# EAGLE design testBoard (EAGLE 9.5.2)
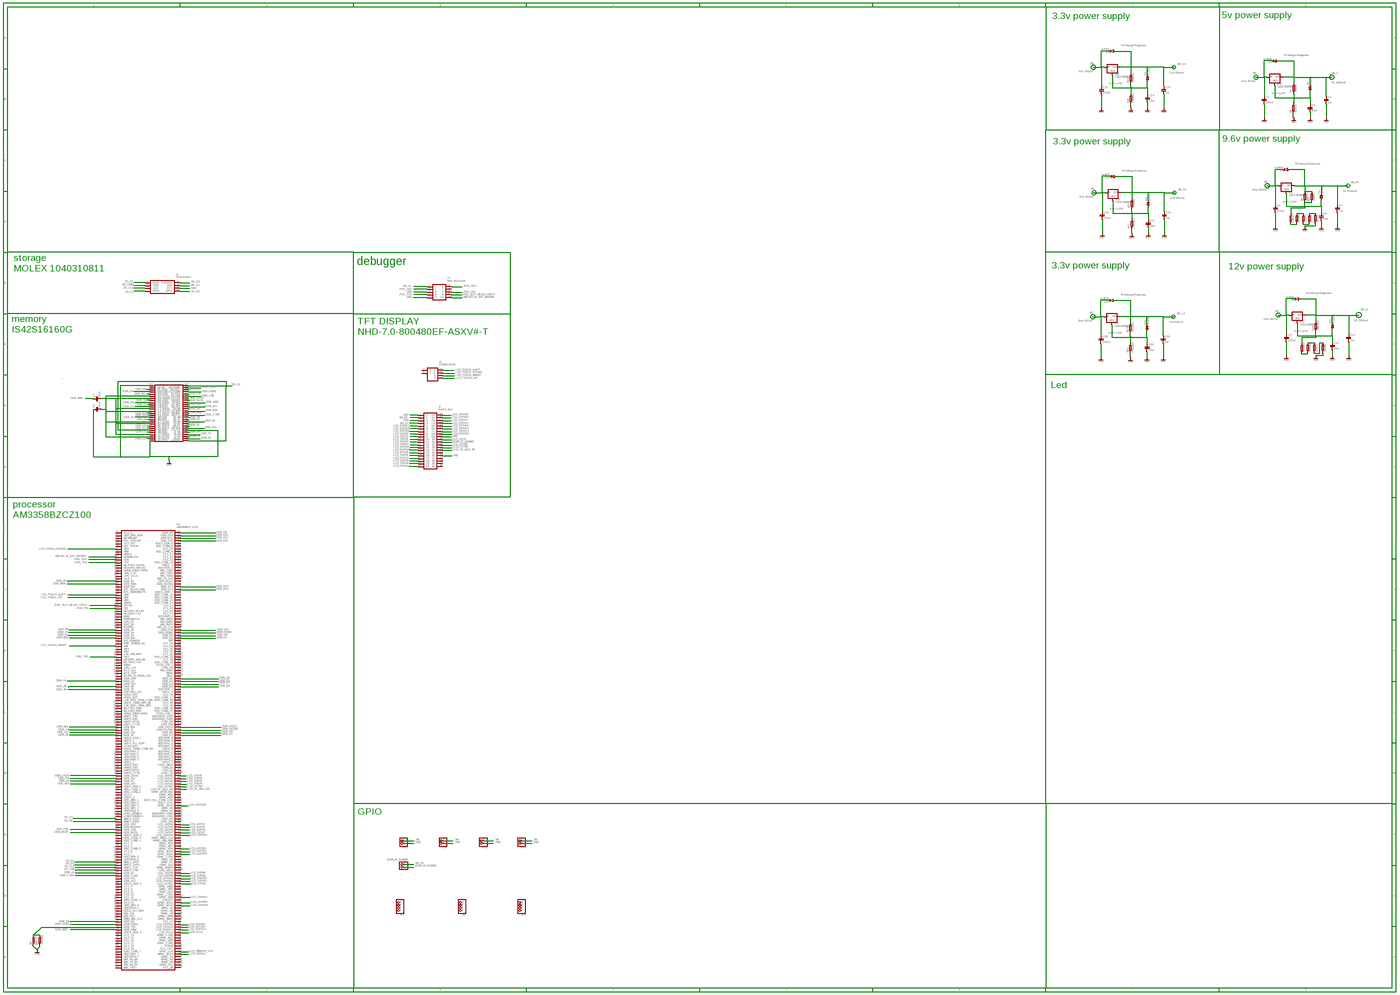
[diagram p0: schematic, sheet 1, overview]
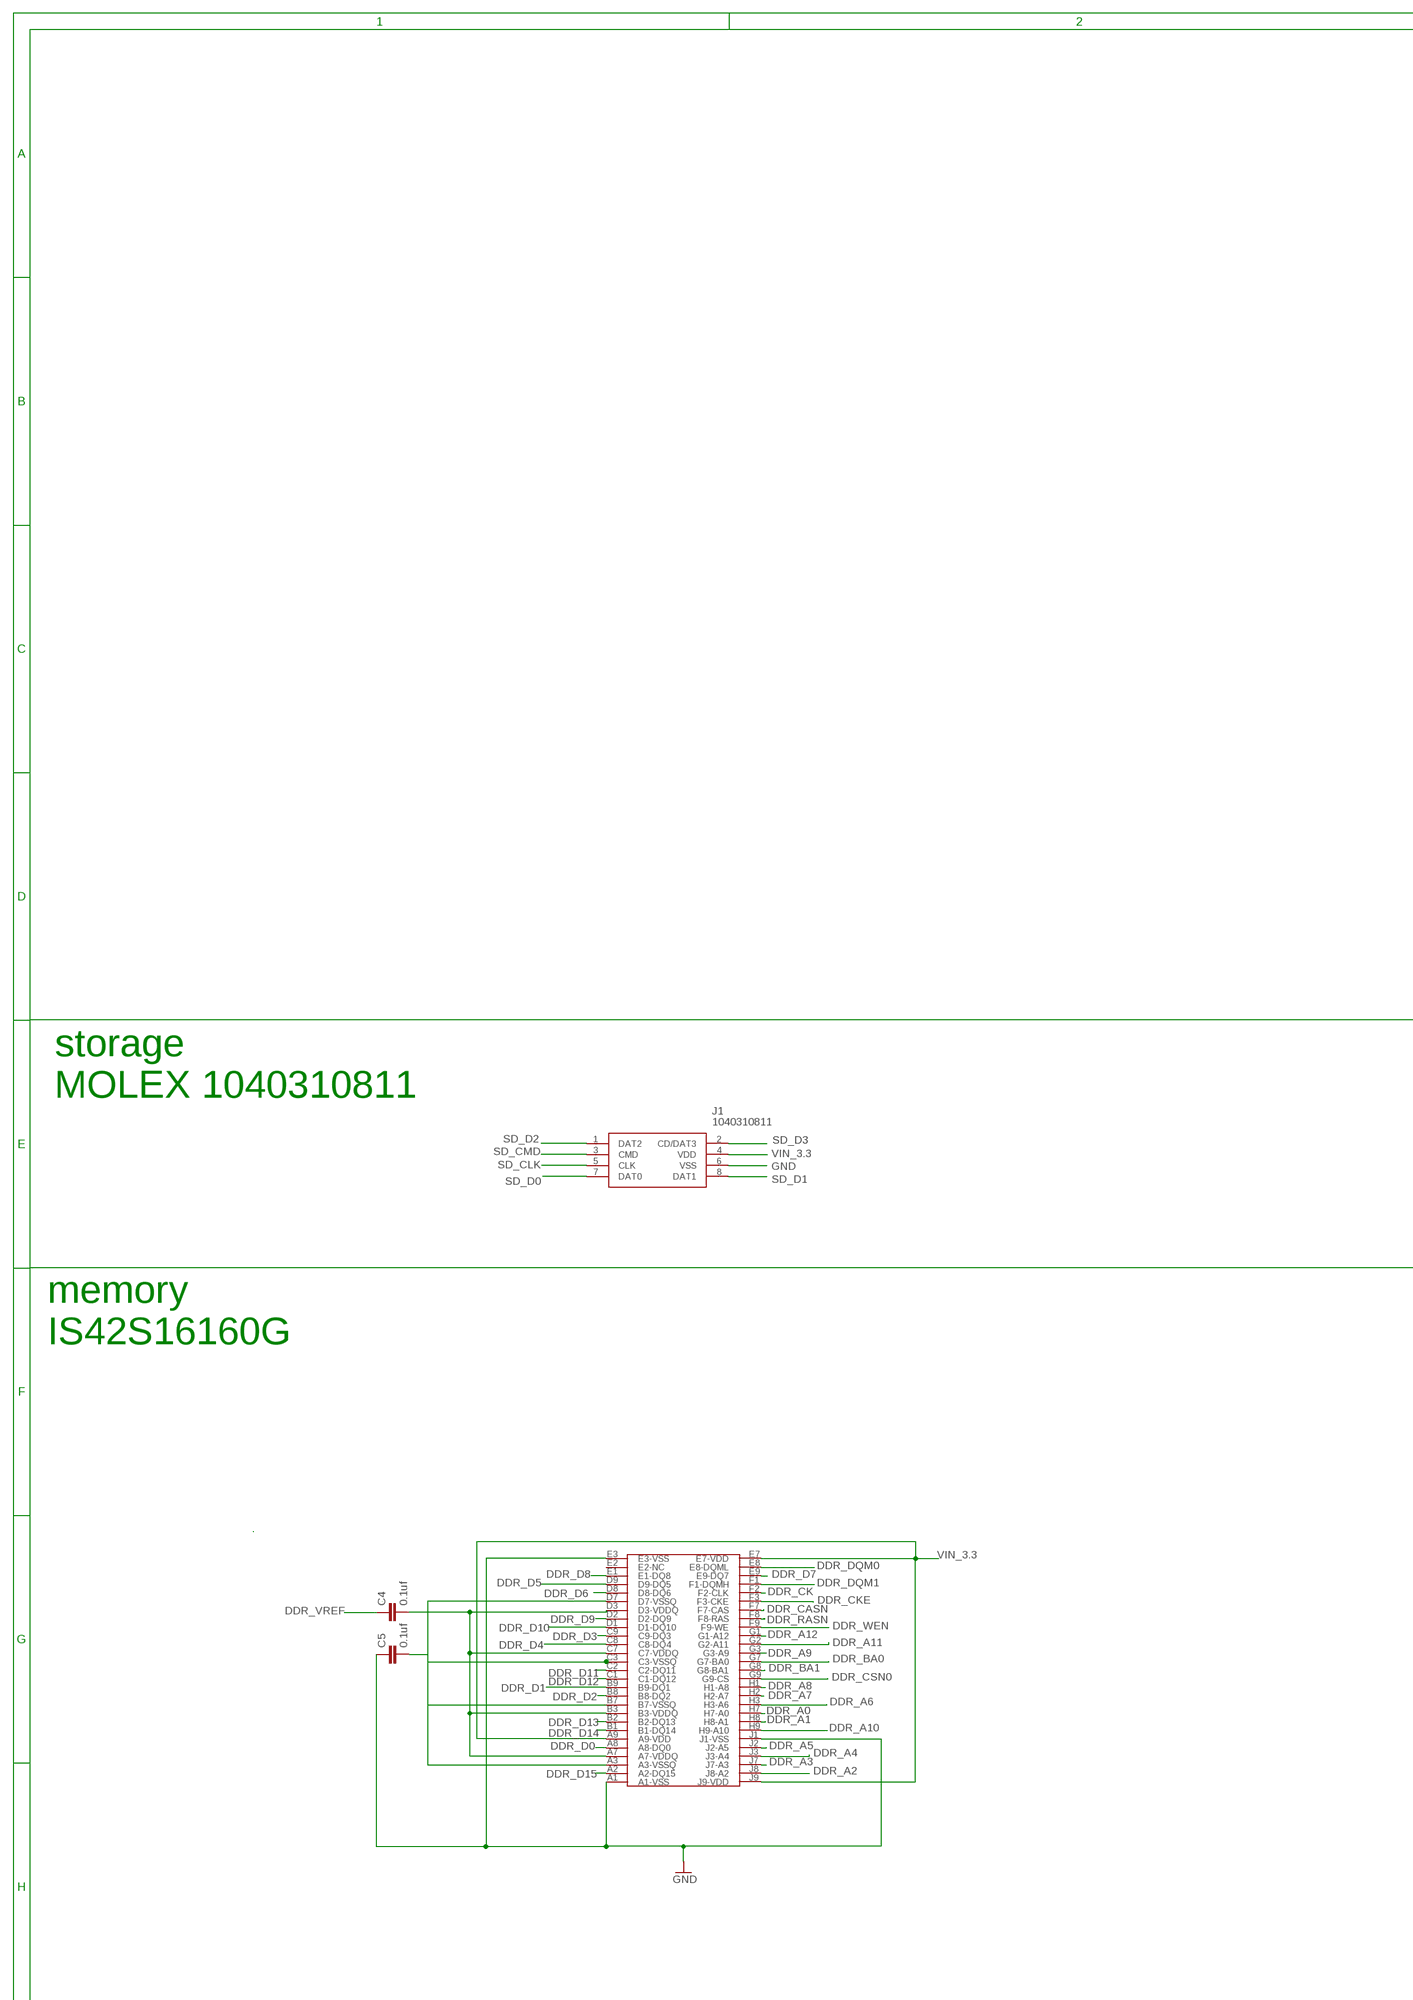
[diagram p1: schematic, sheet 1, part 1 of 8]
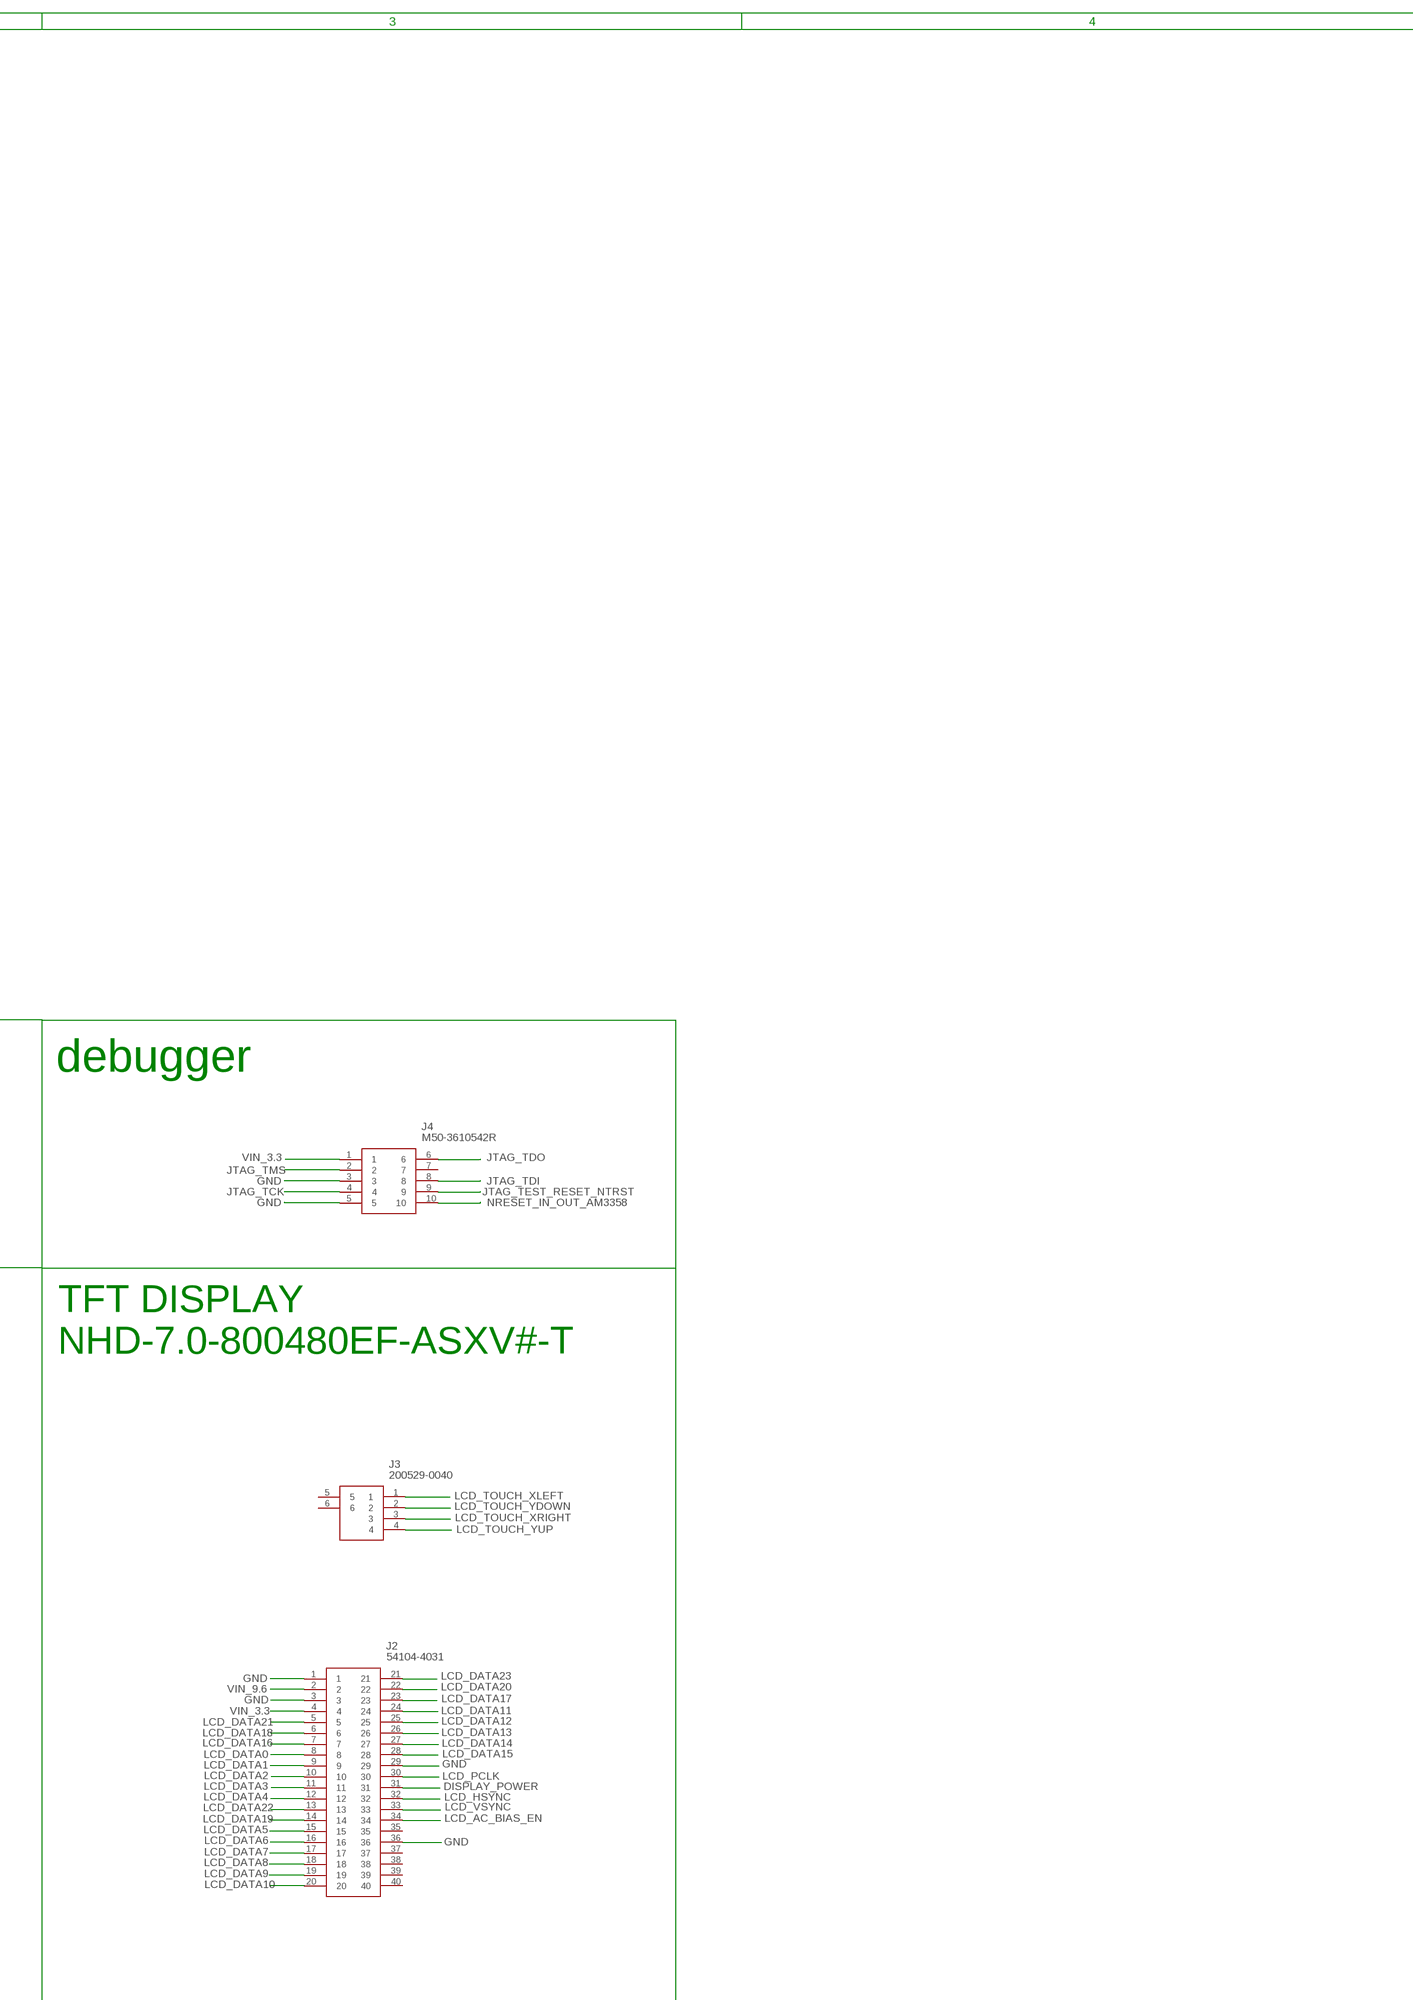
[diagram p2: schematic, sheet 1, part 2 of 8]
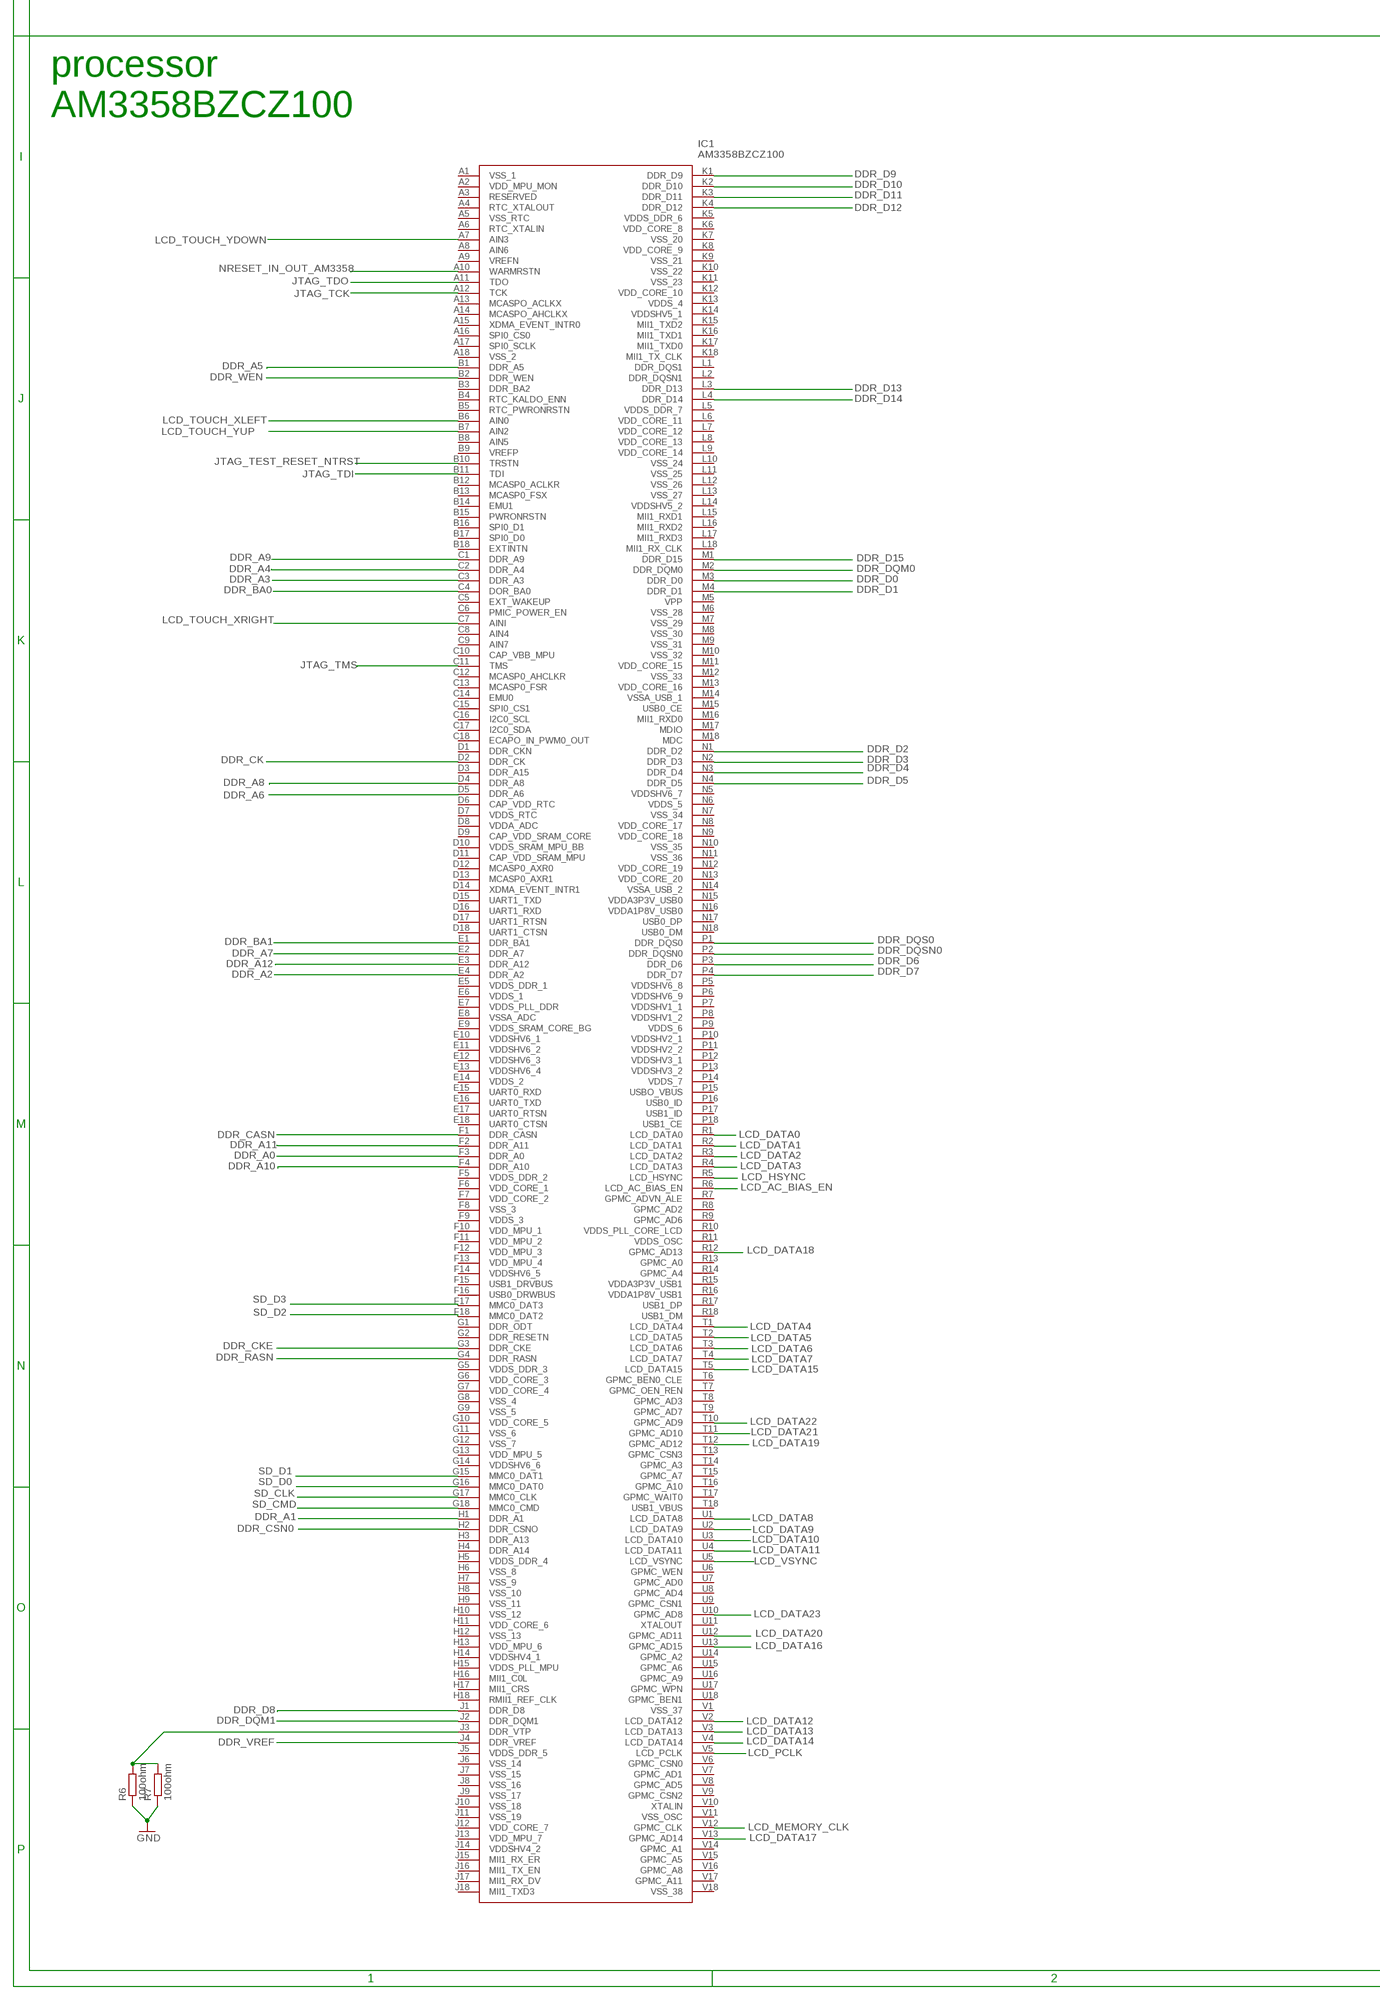
[diagram p3: schematic, sheet 1, part 3 of 8]
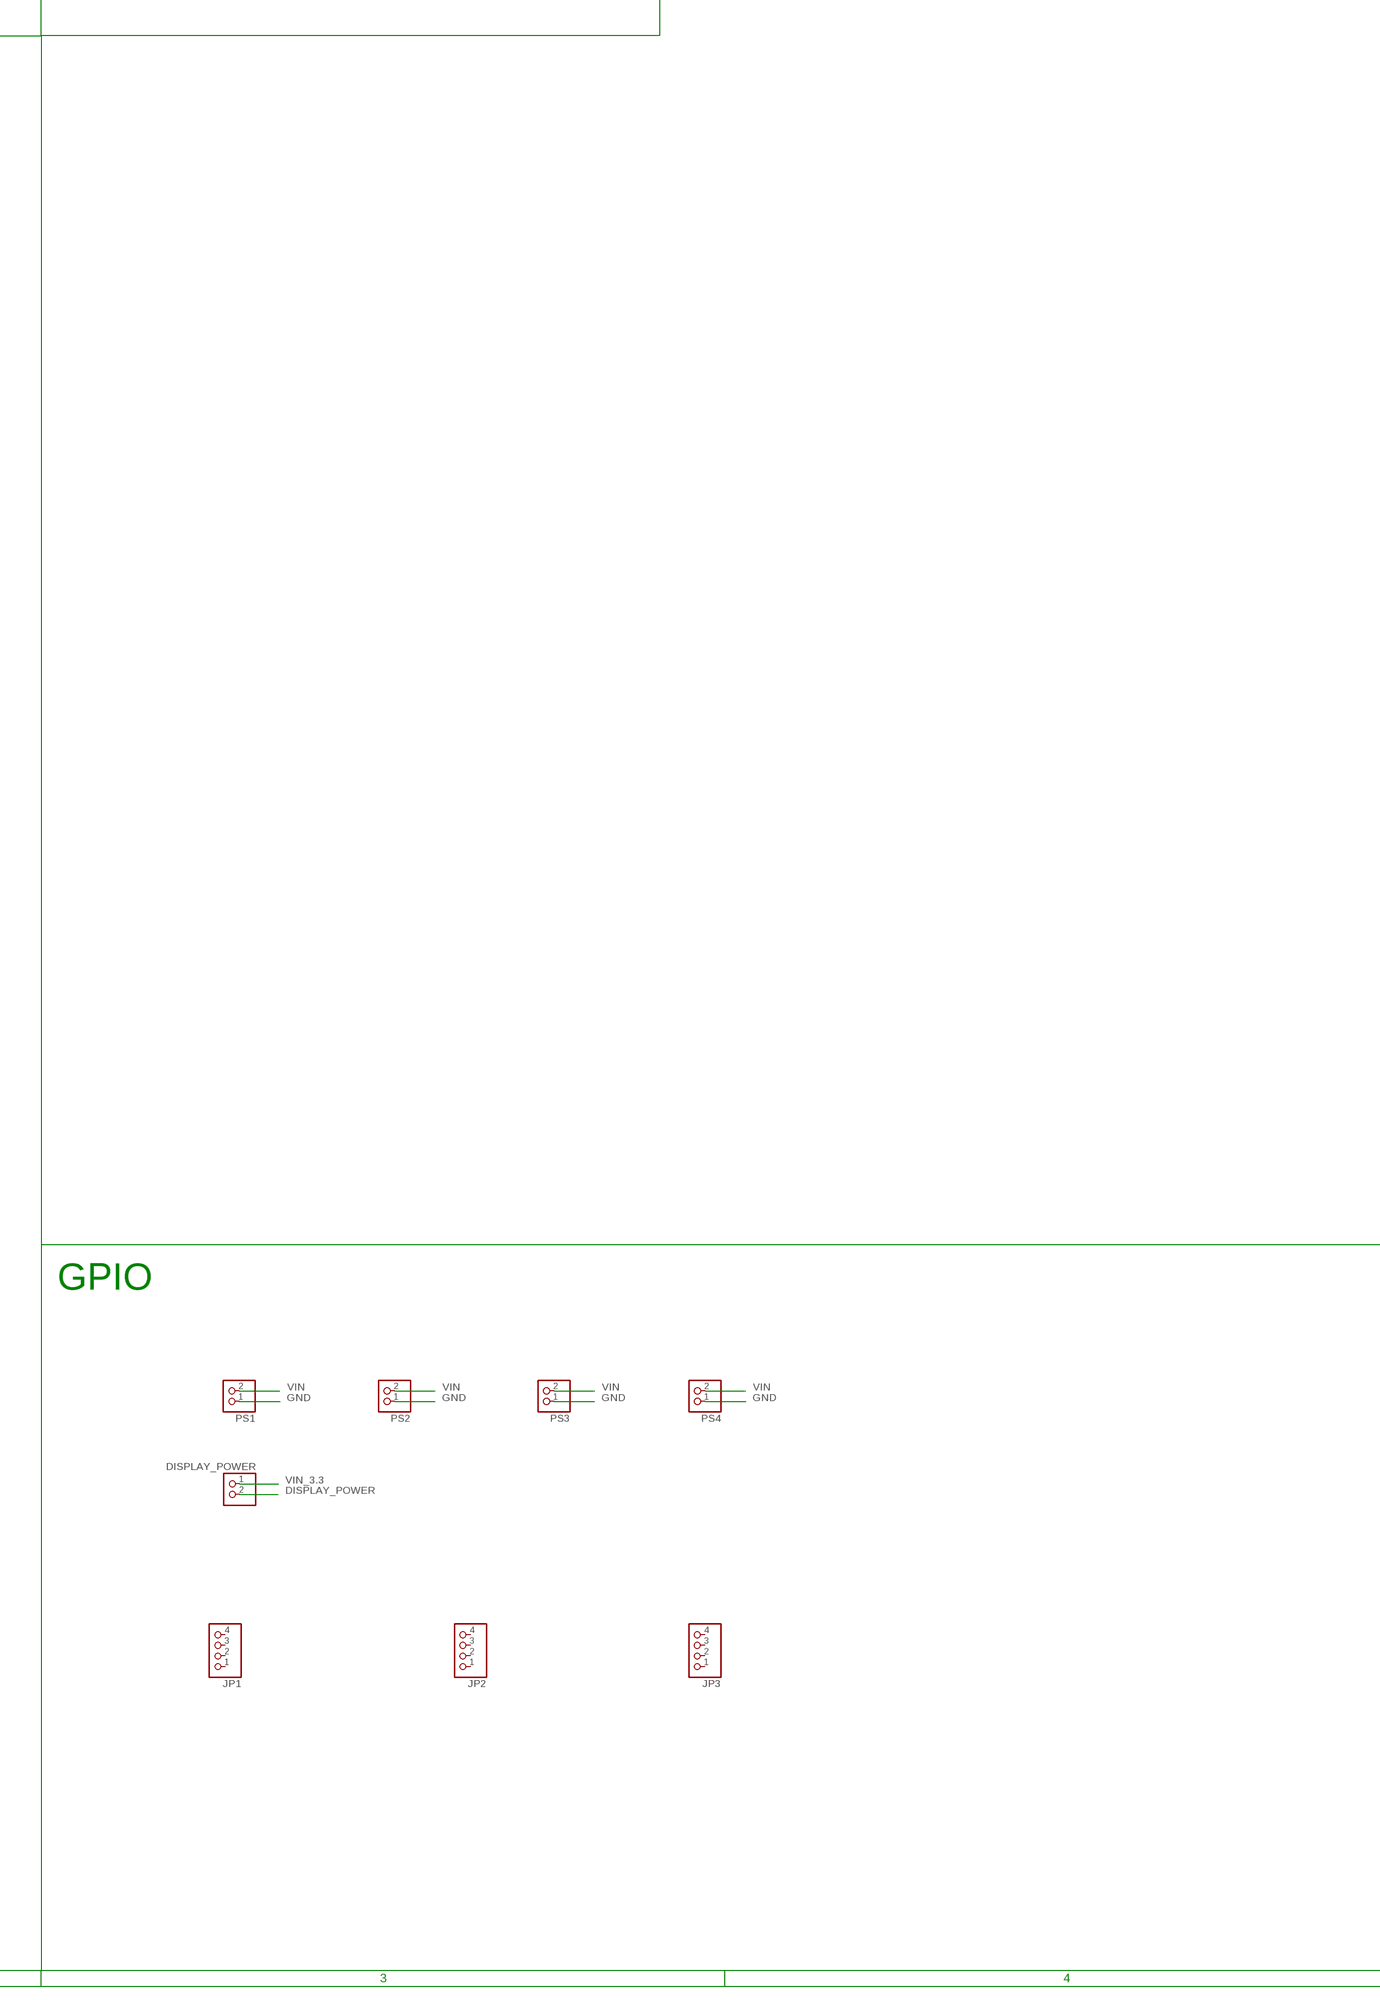
[diagram p4: schematic, sheet 1, part 4 of 8]
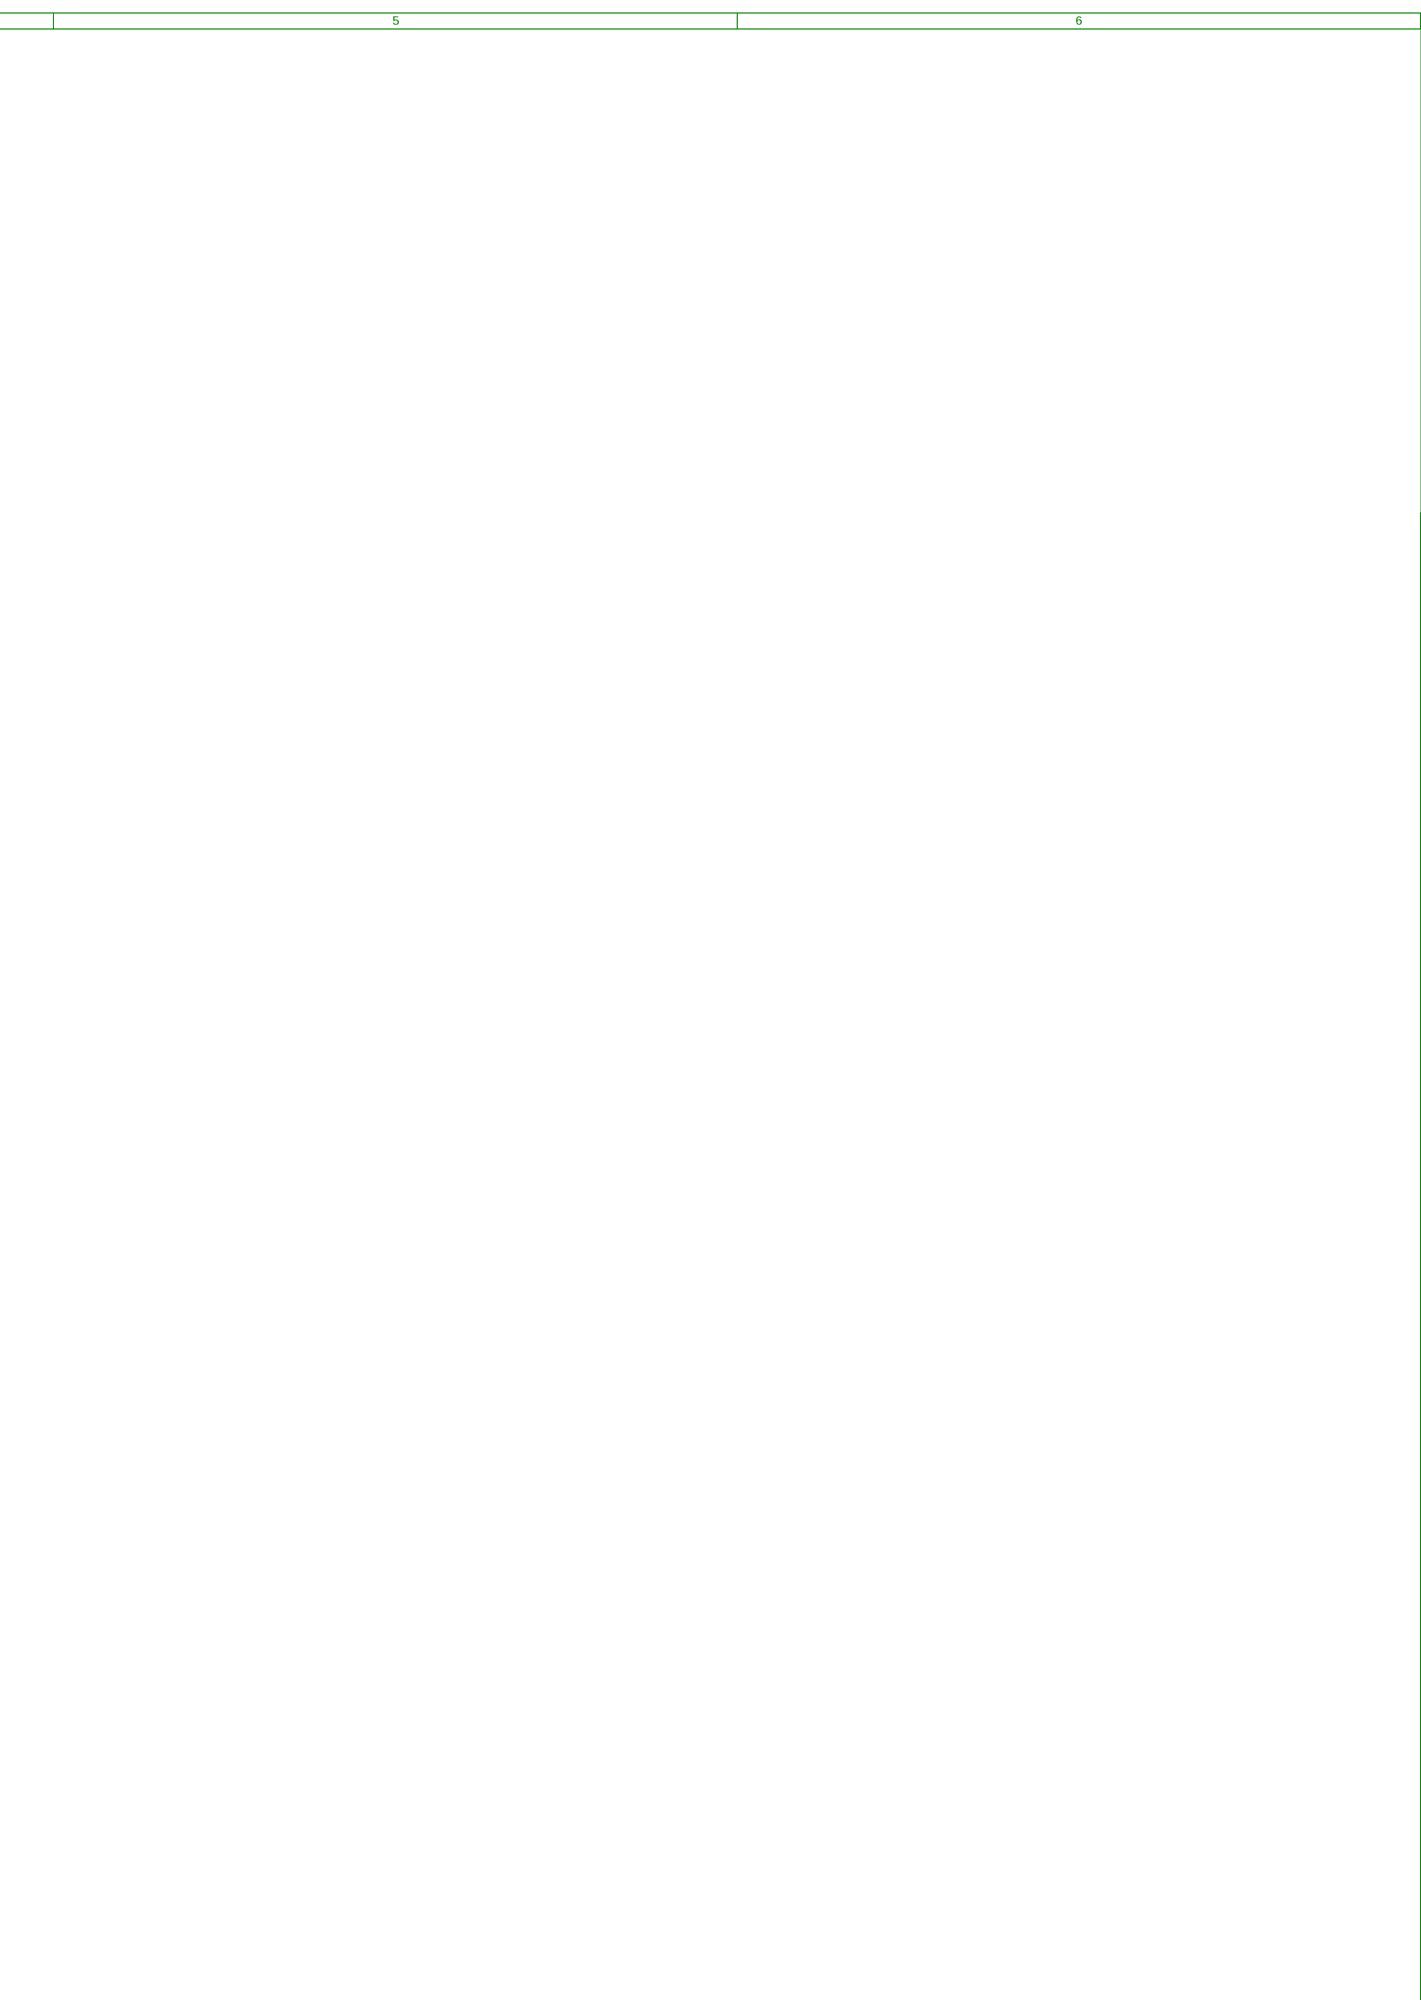
[diagram p5: schematic, sheet 1, part 5 of 8]
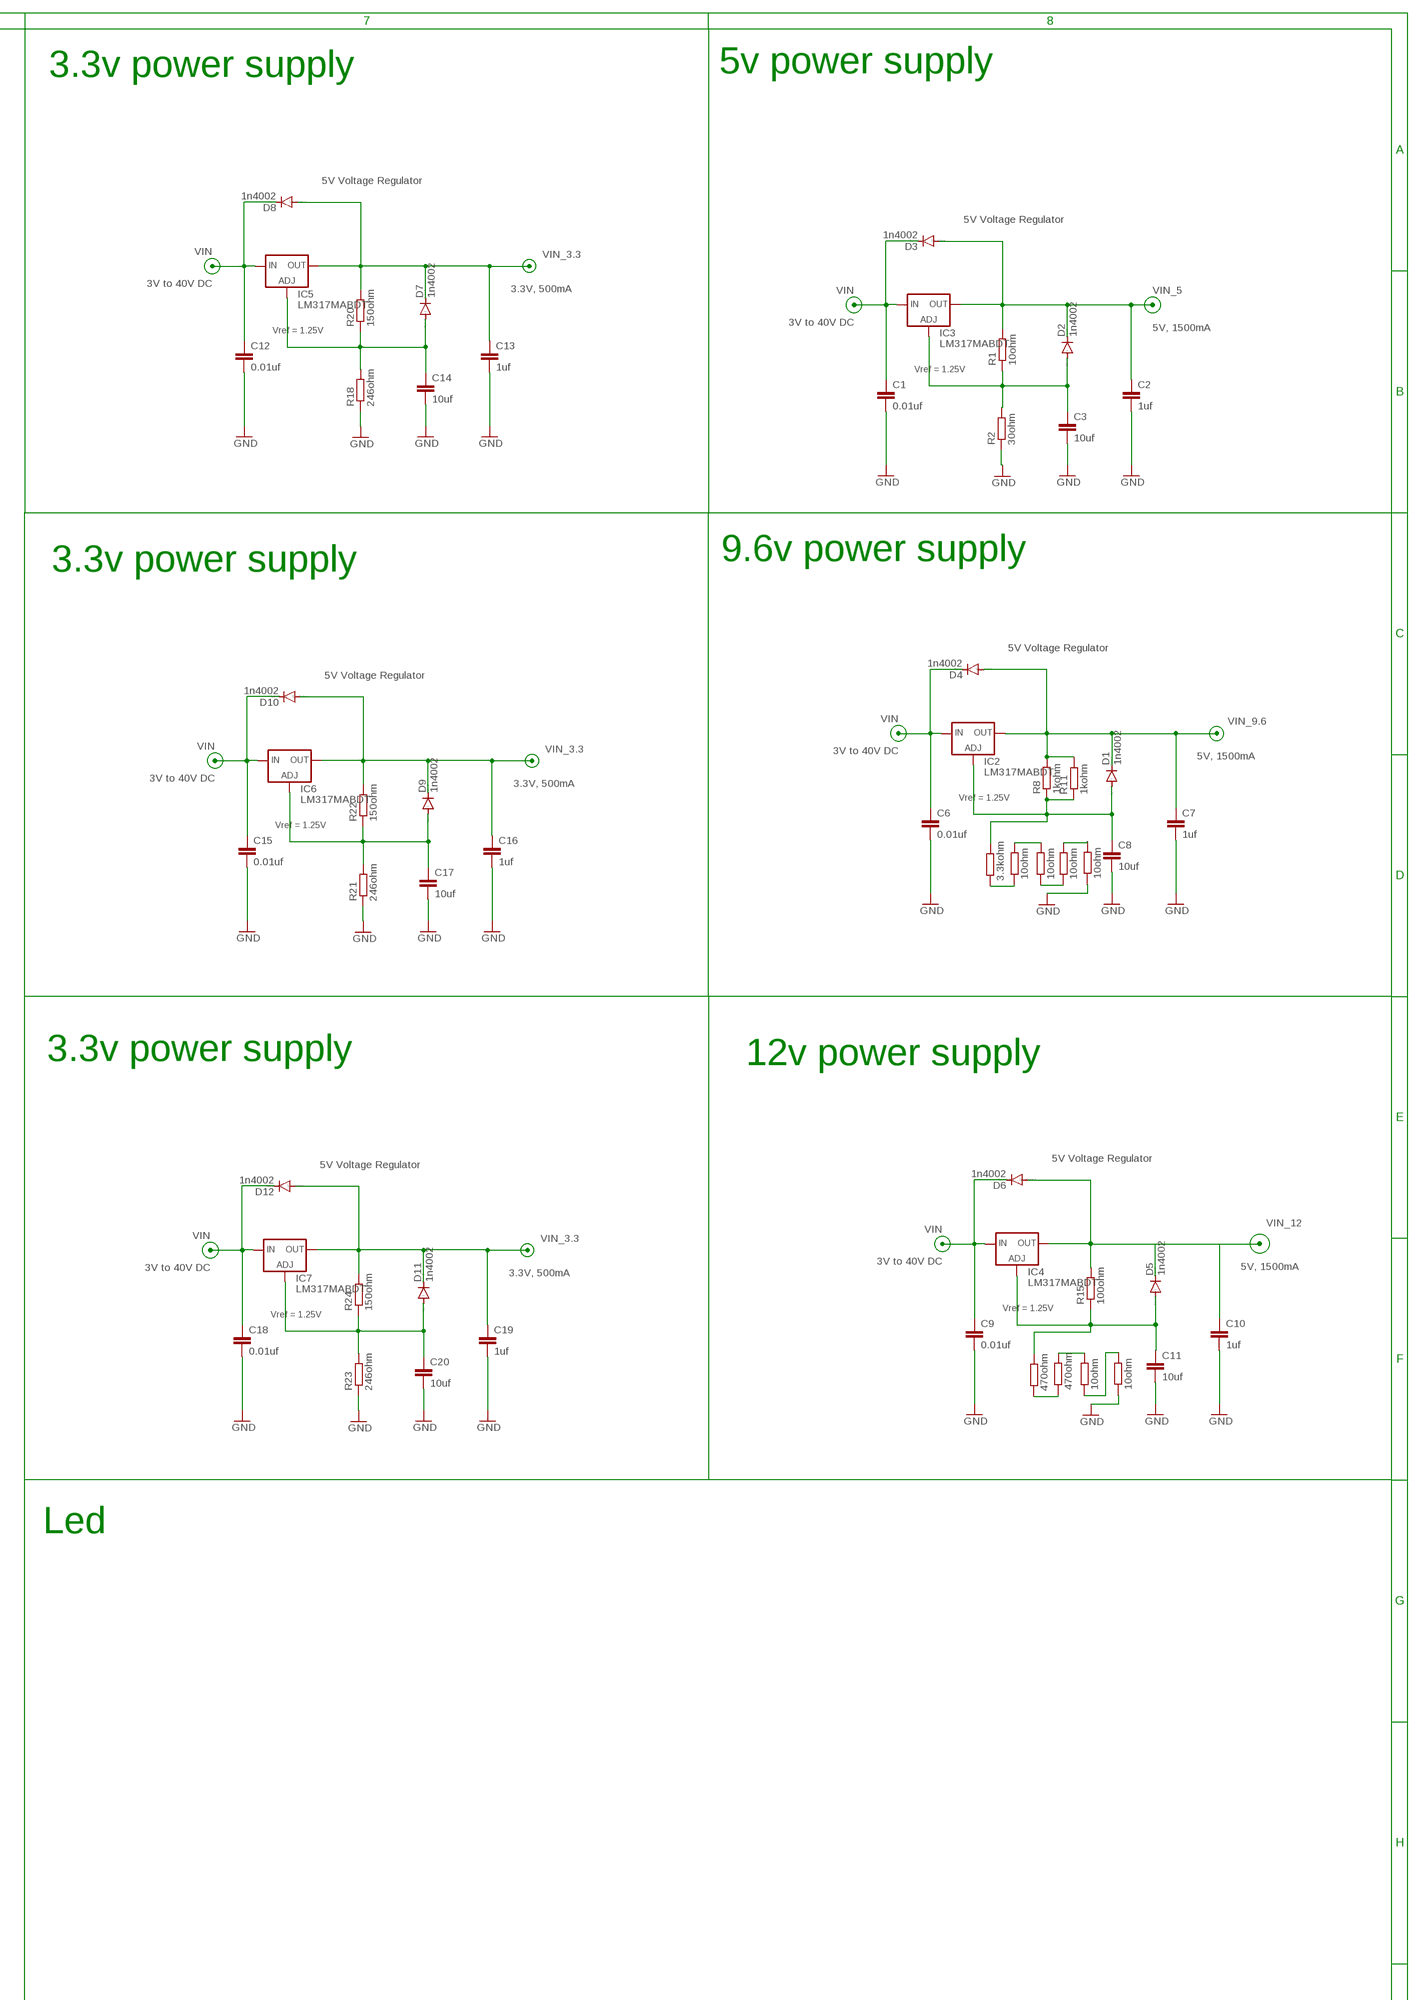
[diagram p6: schematic, sheet 1, part 6 of 8]
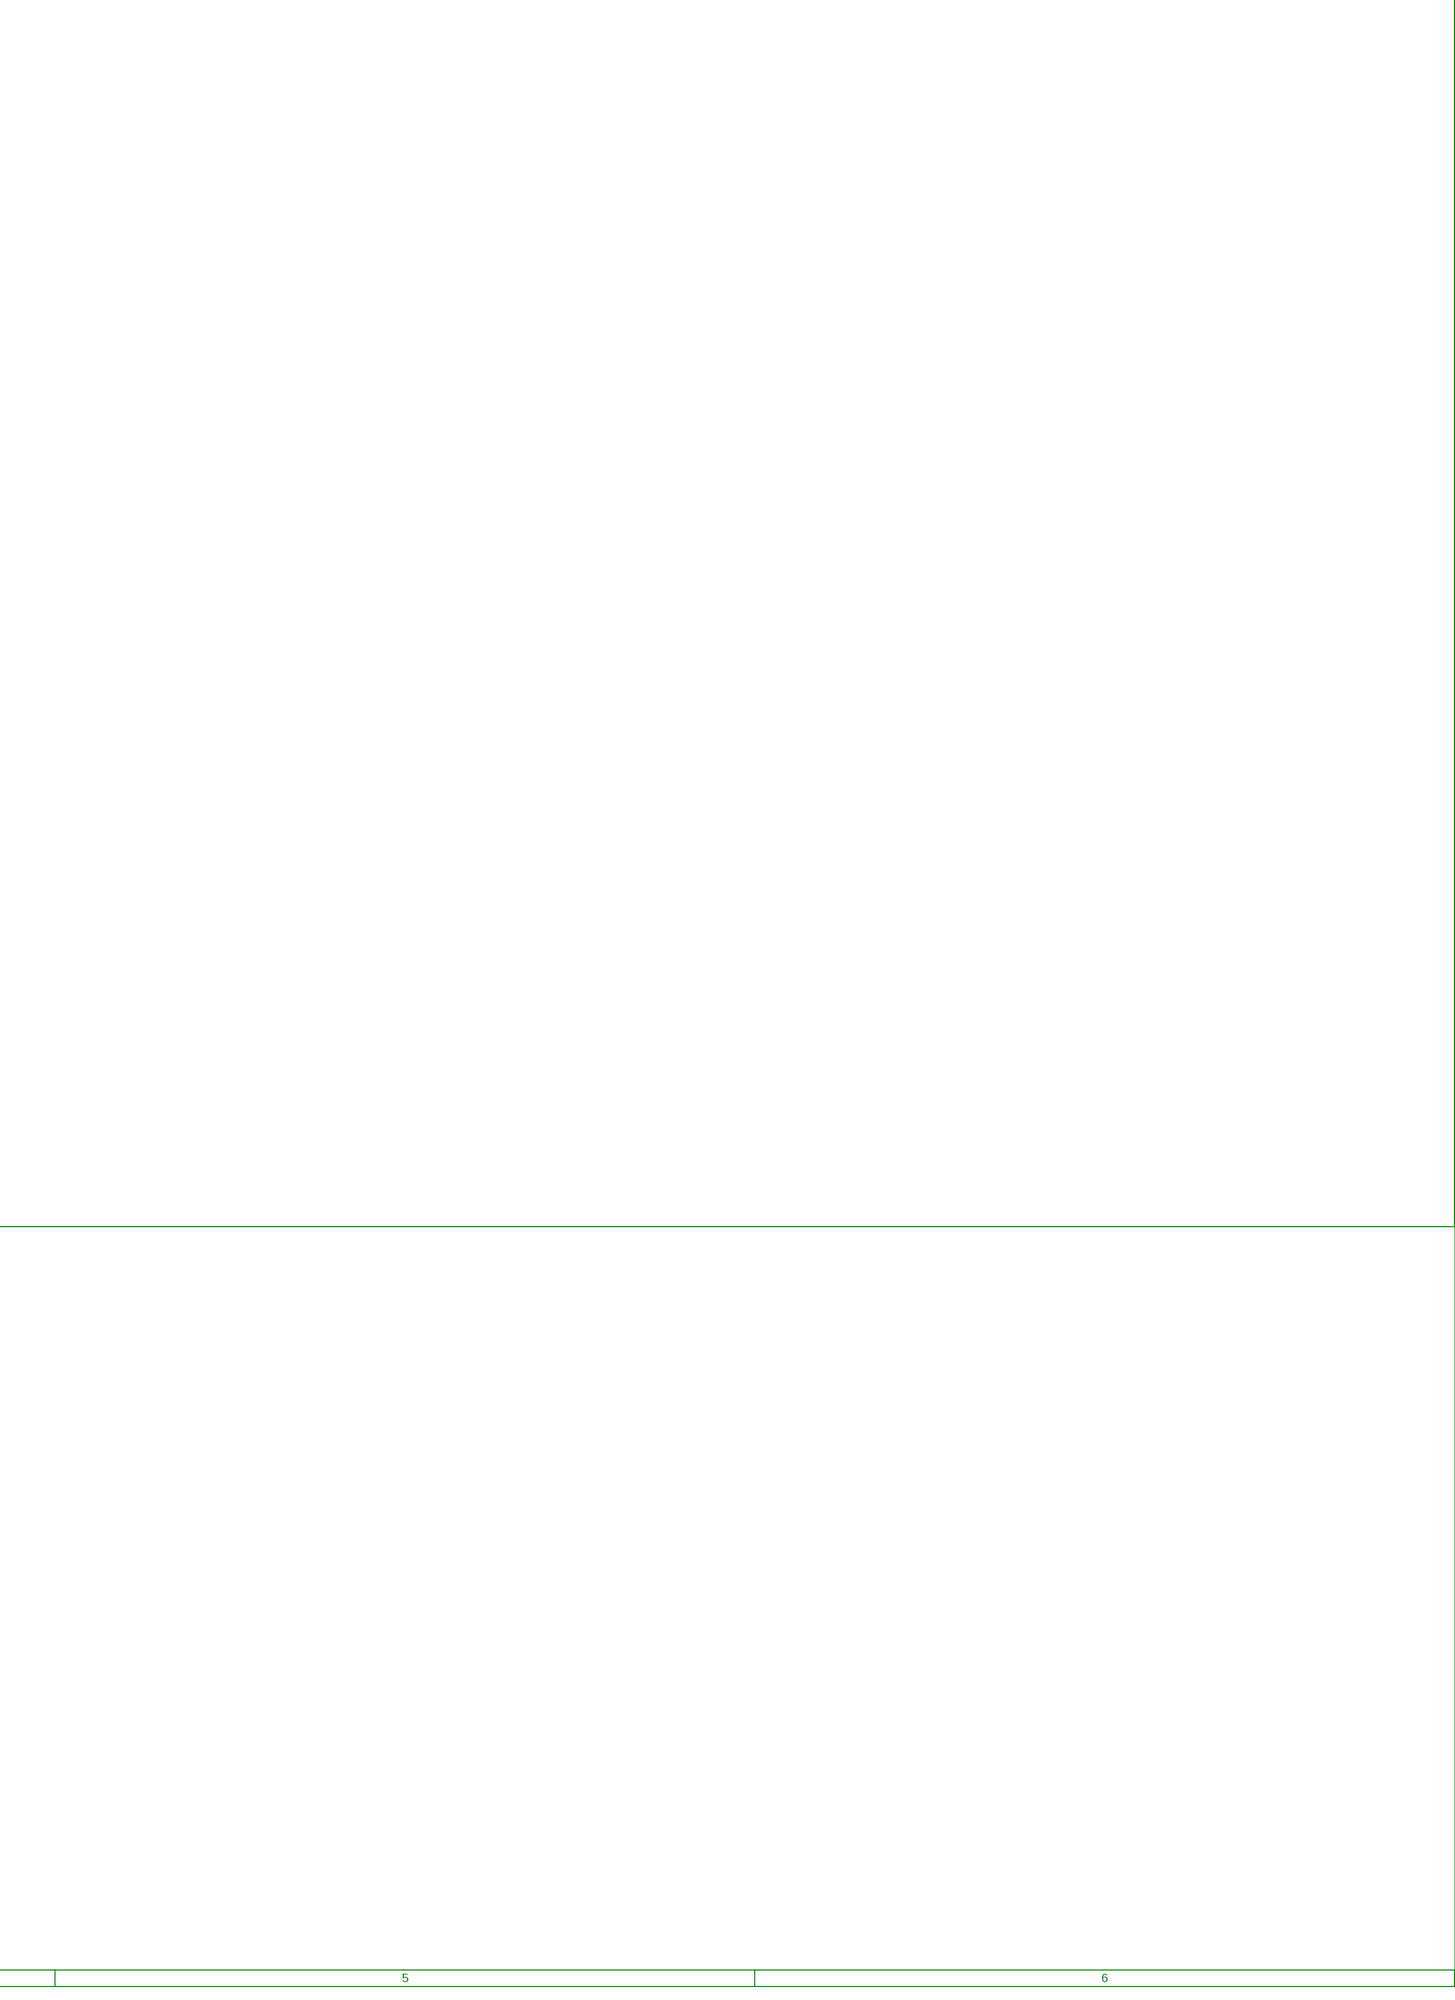
[diagram p7: schematic, sheet 1, part 7 of 8]
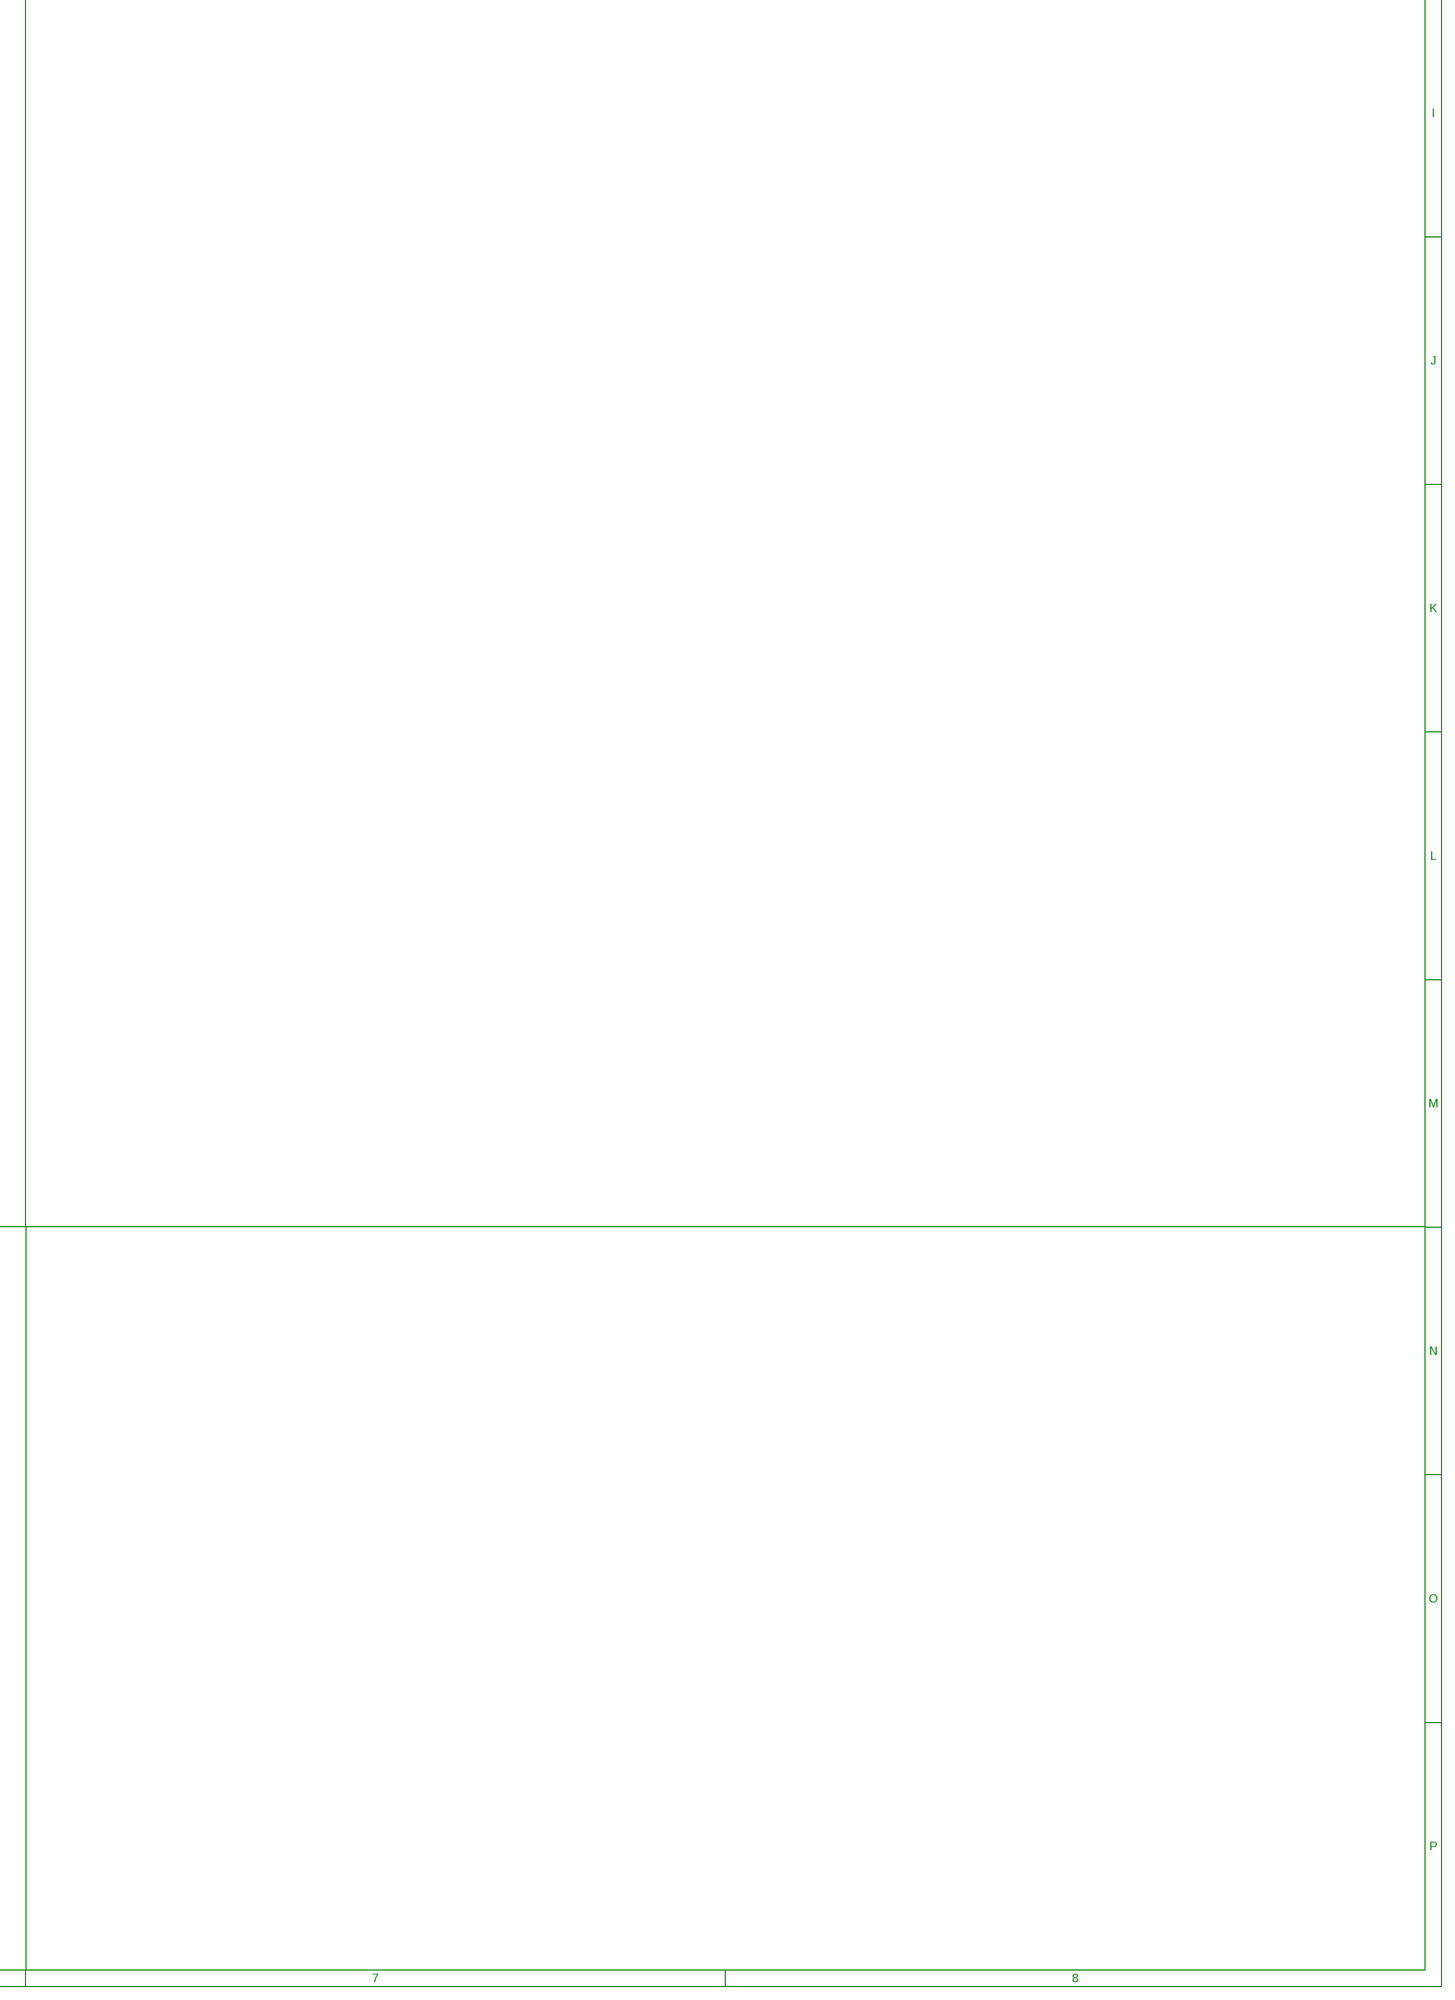
[diagram p8: schematic, sheet 1, part 8 of 8]

## Parts
C1  0.01uf  C-EUC0805  [C0805]
C2  1uf  C-EUC0805  [C0805]
C3  10uf  C-EUC0805  [C0805]
C4  0.1uf  C-EUC0805  [C0805]
C5  0.1uf  C-EUC0805  [C0805]
C6  0.01uf  C-EUC0805  [C0805]
C7  1uf  C-EUC0805  [C0805]
C8  10uf  C-EUC0805  [C0805]
C9  0.01uf  C-EUC0805  [C0805]
C10  1uf  C-EUC0805  [C0805]
C11  10uf  C-EUC0805  [C0805]
C12  0.01uf  C-EUC0805  [C0805]
C13  1uf  C-EUC0805  [C0805]
C14  10uf  C-EUC0805  [C0805]
C15  0.01uf  C-EUC0805  [C0805]
C16  1uf  C-EUC0805  [C0805]
C17  10uf  C-EUC0805  [C0805]
C18  0.01uf  C-EUC0805  [C0805]
C19  1uf  C-EUC0805  [C0805]
C20  10uf  C-EUC0805  [C0805]
D1  1n4002  DIODE-DO-214AC  [DO-214AC]
D2  1n4002  DIODE-DO-214AC  [DO-214AC]
D3  1n4002  DIODE-DO-214AC  [DO-214AC]
D4  1n4002  DIODE-DO-214AC  [DO-214AC]
D5  1n4002  DIODE-DO-214AC  [DO-214AC]
D6  1n4002  DIODE-DO-214AC  [DO-214AC]
D7  1n4002  DIODE-DO-214AC  [DO-214AC]
D8  1n4002  DIODE-DO-214AC  [DO-214AC]
D9  1n4002  DIODE-DO-214AC  [DO-214AC]
D10  1n4002  DIODE-DO-214AC  [DO-214AC]
D11  1n4002  DIODE-DO-214AC  [DO-214AC]
D12  1n4002  DIODE-DO-214AC  [DO-214AC]
DISPLAY_POWER  PINHD-1X2  [1X02]
IC1  AM3358BZCZ100  [BGA324C80P18X18_1500X1500X140]
IC2  LM317MABDT  [DPACK]
IC3  LM317MABDT  [DPACK]
IC4  LM317MABDT  [DPACK]
IC5  LM317MABDT  [DPACK]
IC6  LM317MABDT  [DPACK]
IC7  LM317MABDT  [DPACK]
J1  1040310811  [1040310811]
J2  54104-4031  [54104-4031]
J3  200529-0040  [2005290040]
J4  M50-3610542R  [M503610542]
JP1  PINHD-1X4  [1X04]
JP2  PINHD-1X4  [1X04]
JP3  PINHD-1X4  [1X04]
PS1  PINHD-1X2  [1X02]
PS2  PINHD-1X2  [1X02]
PS3  PINHD-1X2  [1X02]
PS4  PINHD-1X2  [1X02]
R1  10ohm  R-EU_R0805W  [R0805W]
R2  30ohm  R-EU_R0805W  [R0805W]
R5  10ohm  R-EU_R0805W  [R0805W]
R6  100ohm  R-EU_R0805W  [R0805W]
R7  100ohm  R-EU_R0805W  [R0805W]
R8  1kohm  R-EU_R0805W  [R0805W]
R9  10ohm  R-EU_R0805W  [R0805W]
R10  10ohm  R-EU_R0805W  [R0805W]
R11  1kohm  R-EU_R0805W  [R0805W]
R12  3.3kohm  R-EU_R0805W  [R0805W]
R13  10ohm  R-EU_R0805W  [R0805W]
R14  470ohm  R-EU_R0805W  [R0805W]
R15  100ohm  R-EU_R0805W  [R0805W]
R16  10ohm  R-EU_R0805W  [R0805W]
R17  10ohm  R-EU_R0805W  [R0805W]
R18  246ohm  R-EU_R0805W  [R0805W]
R19  470ohm  R-EU_R0805W  [R0805W]
R20  150ohm  R-EU_R0805W  [R0805W]
R21  246ohm  R-EU_R0805W  [R0805W]
R22  150ohm  R-EU_R0805W  [R0805W]
R23  246ohm  R-EU_R0805W  [R0805W]
R24  150ohm  R-EU_R0805W  [R0805W]
U$1  IS42S1610G-5BL  [TF-BGA54]

## Nets
DDR_A0: IC1.F3(DDR_A0) U$1.H7(H7-A0)
DDR_A1: IC1.H1(DDR_A1) U$1.H8(H8-A1)
DDR_A2: IC1.E4(DDR_A2) U$1.J8(J8-A2)
DDR_A3: IC1.C3(DDR_A3) U$1.J7(J7-A3)
DDR_A4: IC1.C2(DDR_A4) U$1.J3(J3-A4)
DDR_A5: IC1.B1(DDR_A5) U$1.J2(J2-A5)
DDR_A6: IC1.D5(DDR_A6) U$1.H3(H3-A6)
DDR_A7: IC1.E2(DDR_A7) U$1.H2(H2-A7)
DDR_A8: IC1.D4(DDR_A8) U$1.H1(H1-A8)
DDR_A9: IC1.C1(DDR_A9) U$1.G3(G3-A9)
DDR_A10: IC1.F4(DDR_A10) U$1.H9(H9-A10)
DDR_A11: IC1.F2(DDR_A11) U$1.G2(G2-A11)
DDR_A12: IC1.E3(DDR_A12) U$1.G1(G1-A12)
DDR_BA0: IC1.C4(DOR_BA0) U$1.G7(G7-BA0)
DDR_BA1: IC1.E1(DDR_BA1) U$1.G8(G8-BA1)
DDR_CASN: IC1.F1(DDR_CASN) U$1.F7(F7-CAS)
DDR_CK: IC1.D2(DDR_CK) U$1.F2(F2-CLK)
DDR_CKE: IC1.G3(DDR_CKE) U$1.F3(F3-CKE)
DDR_CSN0: IC1.H2(DDR_CSNO) U$1.G9(G9-CS)
DDR_D0: IC1.M3(DDR_D0) U$1.A8(A8-DQ0)
DDR_D1: IC1.M4(DDR_D1) U$1.B9(B9-DQ1)
DDR_D2: IC1.N1(DDR_D2) U$1.B8(B8-DQ2)
DDR_D3: IC1.N2(DDR_D3) U$1.C9(C9-DQ3)
DDR_D4: IC1.N3(DDR_D4) U$1.C8(C8-DQ4)
DDR_D5: IC1.N4(DDR_D5) U$1.D9(D9-DQ5)
DDR_D6: IC1.P3(DDR_D6) U$1.D8(D8-DQ6)
DDR_D7: IC1.P4(DDR_D7) U$1.E9(E9-DQ7)
DDR_D8: IC1.J1(DDR_D8) U$1.E1(E1-DQ8)
DDR_D9: IC1.K1(DDR_D9) U$1.D2(D2-DQ9)
DDR_D10: IC1.K2(DDR_D10) U$1.D1(D1-DQ10)
DDR_D11: IC1.K3(DDR_D11) U$1.C2(C2-DQ11)
DDR_D12: IC1.K4(DDR_D12) U$1.C1(C1-DQ12)
DDR_D13: IC1.L3(DDR_D13) U$1.B2(B2-DQ13)
DDR_D14: IC1.L4(DDR_D14) U$1.B1(B1-DQ14)
DDR_D15: IC1.M1(DDR_D15) U$1.A2(A2-DQ15)
DDR_DQM0: IC1.M2(DDR_DQM0) U$1.E8(E8-DQML)
DDR_DQM1: IC1.J2(DDR_DQM1) U$1.F1(F1-DQMH)
DDR_DQS0: IC1.P1(DDR_DQS0)
DDR_DQSN0: IC1.P2(DDR_DQSN0)
DDR_RASN: IC1.G4(DDR_RASN) U$1.F8(F8-RAS)
DDR_VREF: C4.1 IC1.J4(DDR_VREF)
DDR_WEN: IC1.B2(DDR_WEN) U$1.F9(F9-WE)
DISPLAY_POWER: DISPLAY_POWER.2 J2.31
GND: C1.2 C2.2 C3.2 C5.1 C6.2 C7.2 C8.2 C9.2 C10.2 C11.2 C12.2 C13.2 C14.2 C15.2 C16.2 C17.2 C18.2 C19.2 C20.2 J1.6(VSS) J2.1 J2.3 J2.29 J2.36 J4.3 J4.5 PS1.1 PS2.1 PS3.1 PS4.1 R2.1 R6.1 R7.1 R13.1 R17.1 R18.1 R21.1 R23.1 U$1.A1(A1-VSS) U$1.E3(E3-VSS) U$1.J1(J1-VSS)
JTAG_TCK: IC1.A12(TCK) J4.4
JTAG_TDI: IC1.B11(TDI) J4.8
JTAG_TDO: IC1.A11(TDO) J4.6
JTAG_TEST_RESET_NTRST: IC1.B10(TRSTN) J4.9
JTAG_TMS: IC1.C11(TMS) J4.2
LCD_AC_BIAS_EN: IC1.R6(LCD_AC_BIAS_EN) J2.34
LCD_DATA0: IC1.R1(LCD_DATA0) J2.8
LCD_DATA1: IC1.R2(LCD_DATA1) J2.9
LCD_DATA2: IC1.R3(LCD_DATA2) J2.10
LCD_DATA3: IC1.R4(LCD_DATA3) J2.11
LCD_DATA4: IC1.T1(LCD_DATA4) J2.12
LCD_DATA5: IC1.T2(LCD_DATA5) J2.15
LCD_DATA6: IC1.T3(LCD_DATA6) J2.16
LCD_DATA7: IC1.T4(LCD_DATA7) J2.17
LCD_DATA8: IC1.U1(LCD_DATA8) J2.18
LCD_DATA9: IC1.U2(LCD_DATA9) J2.19
LCD_DATA10: IC1.U3(LCD_DATA10) J2.20
LCD_DATA11: IC1.U4(LCD_DATA11) J2.24
LCD_DATA12: IC1.V2(LCD_DATA12) J2.25
LCD_DATA13: IC1.V3(LCD_DATA13) J2.26
LCD_DATA14: IC1.V4(LCD_DATA14) J2.27
LCD_DATA15: IC1.T5(LCD_DATA15) J2.28
LCD_DATA16: IC1.U13(GPMC_AD15) J2.7
LCD_DATA17: IC1.V13(GPMC_AD14) J2.23
LCD_DATA18: IC1.R12(GPMC_AD13) J2.6
LCD_DATA19: IC1.T12(GPMC_AD12) J2.14
LCD_DATA20: IC1.U12(GPMC_AD11) J2.22
LCD_DATA21: IC1.T11(GPMC_AD10) J2.5
LCD_DATA22: IC1.T10(GPMC_AD9) J2.13
LCD_DATA23: IC1.U10(GPMC_AD8) J2.21
LCD_HSYNC: IC1.R5(LCD_HSYNC) J2.32
LCD_MEMORY_CLK: IC1.V12(GPMC_CLK)
LCD_PCLK: IC1.V5(LCD_PCLK) J2.30
LCD_TOUCH_XLEFT: IC1.B6(AIN0) J3.1
LCD_TOUCH_XRIGHT: IC1.C7(AINI) J3.3
LCD_TOUCH_YDOWN: IC1.A7(AIN3) J3.2
LCD_TOUCH_YUP: IC1.B7(AIN2) J3.4
LCD_VSYNC: IC1.U5(LCD_VSYNC) J2.33
N$1: IC1.J3(DDR_VTP) R6.2 R7.2
N$3: C4.2 U$1.A7(A7-VDDQ) U$1.B3(B3-VDDQ) U$1.C7(C7-VDDQ) U$1.D3(D3-VDDQ)
N$4: C5.2 U$1.A3(A3-VSSQ) U$1.B7(B7-VSSQ) U$1.C3(C3-VSSQ) U$1.D7(D7-VSSQ)
N$6: C14.1 D7.A IC5.1(ADJ) R18.2 R20.1
N$7: C17.1 D9.A IC6.1(ADJ) R21.2 R22.1
N$9: C3.1 D2.A IC3.1(ADJ) R1.1 R2.2
N$10: C20.1 D11.A IC7.1(ADJ) R23.2 R24.1
N$40: R5.1 R12.1
N$42: C8.1 D1.A IC2.1(ADJ) R8.1 R11.1 R12.2
N$43: R5.2 R9.2
N$44: R9.1 R10.1
N$45: R10.2 R13.2
N$46: C11.1 D5.A IC4.1(ADJ) R15.1 R19.2
N$47: R14.1 R19.1
N$48: R14.2 R16.2
N$49: R16.1 R17.2
NRESET_IN_OUT_AM3358: IC1.A10(WARMRSTN) J4.10
SD_CLK: IC1.G17(MMC0_CLK) J1.5(CLK)
SD_CMD: IC1.G18(MMC0_CMD) J1.3(CMD)
SD_D0: IC1.G16(MMC0_DAT0) J1.7(DAT0)
SD_D1: IC1.G15(MMC0_DAT1) J1.8(DAT1)
SD_D2: IC1.F18(MMC0_DAT2) J1.1(DAT2)
SD_D3: IC1.F17(MMC0_DAT3) J1.2(CD/DAT3)
VIN: C1.1 C6.1 C9.1 C12.1 C15.1 C18.1 D3.C D4.C D6.C D8.C D10.C D12.C IC2.3(IN) IC3.3(IN) IC4.3(IN) IC5.3(IN) IC6.3(IN) IC7.3(IN) PS1.2 PS2.2 PS3.2 PS4.2
VIN_3.3: C13.1 C16.1 C19.1 D7.C D8.A D9.C D10.A D11.C D12.A DISPLAY_POWER.1 IC5.4(OUT) IC6.4(OUT) IC7.4(OUT) J1.4(VDD) J2.4 J4.1 R20.2 R22.2 R24.2 U$1.A9(A9-VDD) U$1.E7(E7-VDD) U$1.J9(J9-VDD)
VIN_5: C2.1 D2.C D3.A IC3.4(OUT) R1.2
VIN_9.6: C7.1 D1.C D4.A IC2.4(OUT) J2.2 R8.2 R11.2
VIN_12: C10.1 D5.C D6.A IC4.4(OUT) R15.2
Unconnected: IC1.A1(VSS_1) IC1.A2(VDD_MPU_MON) IC1.A3(RESERVED) IC1.A4(RTC_XTALOUT) IC1.A5(VSS_RTC) IC1.A6(RTC_XTALIN) IC1.A8(AIN6) IC1.A9(VREFN) IC1.A13(MCASPO_ACLKX) IC1.A14(MCASPO_AHCLKX) IC1.A15(XDMA_EVENT_INTR0) IC1.A16(SPI0_CS0) IC1.A17(SPI0_SCLK) IC1.A18(VSS_2) IC1.B3(DDR_BA2) IC1.B4(RTC_KALDO_ENN) IC1.B5(RTC_PWRONRSTN) IC1.B8(AIN5) IC1.B9(VREFP) IC1.B12(MCASP0_ACLKR) IC1.B13(MCASP0_FSX) IC1.B14(EMU1) IC1.B15(PWRONRSTN) IC1.B16(SPI0_D1) IC1.B17(SPI0_D0) IC1.B18(EXTINTN) IC1.C5(EXT_WAKEUP) IC1.C6(PMIC_POWER_EN) IC1.C8(AIN4) IC1.C9(AIN7) IC1.C10(CAP_VBB_MPU) IC1.C12(MCASP0_AHCLKR) IC1.C13(MCASP0_FSR) IC1.C14(EMU0) IC1.C15(SPI0_CS1) IC1.C16(I2C0_SCL) IC1.C17(I2C0_SDA) IC1.C18(ECAPO_IN_PWM0_OUT) IC1.D1(DDR_CKN) IC1.D3(DDR_A15) IC1.D6(CAP_VDD_RTC) IC1.D7(VDDS_RTC) IC1.D8(VDDA_ADC) IC1.D9(CAP_VDD_SRAM_CORE) IC1.D10(VDDS_SRAM_MPU_BB) IC1.D11(CAP_VDD_SRAM_MPU) IC1.D12(MCASP0_AXR0) IC1.D13(MCASP0_AXR1) IC1.D14(XDMA_EVENT_INTR1) IC1.D15(UART1_TXD) IC1.D16(UART1_RXD) IC1.D17(UART1_RTSN) IC1.D18(UART1_CTSN) IC1.E5(VDDS_DDR_1) IC1.E6(VDDS_1) IC1.E7(VDDS_PLL_DDR) IC1.E8(VSSA_ADC) IC1.E9(VDDS_SRAM_CORE_BG) IC1.E10(VDDSHV6_1) IC1.E11(VDDSHV6_2) IC1.E12(VDDSHV6_3) IC1.E13(VDDSHV6_4) IC1.E14(VDDS_2) IC1.E15(UART0_RXD) IC1.E16(UART0_TXD) IC1.E17(UART0_RTSN) IC1.E18(UART0_CTSN) IC1.F5(VDDS_DDR_2) IC1.F6(VDD_CORE_1) IC1.F7(VDD_CORE_2) IC1.F8(VSS_3) IC1.F9(VDDS_3) IC1.F10(VDD_MPU_1) IC1.F11(VDD_MPU_2) IC1.F12(VDD_MPU_3) IC1.F13(VDD_MPU_4) IC1.F14(VDDSHV6_5) IC1.F15(USB1_DRVBUS) IC1.F16(USB0_DRWBUS) IC1.G1(DDR_ODT) IC1.G2(DDR_RESETN) IC1.G5(VDDS_DDR_3) IC1.G6(VDD_CORE_3) IC1.G7(VDD_CORE_4) IC1.G8(VSS_4) IC1.G9(VSS_5) IC1.G10(VDD_CORE_5) IC1.G11(VSS_6) IC1.G12(VSS_7) IC1.G13(VDD_MPU_5) IC1.G14(VDDSHV6_6) IC1.H3(DDR_A13) IC1.H4(DDR_A14) IC1.H5(VDDS_DDR_4) IC1.H6(VSS_8) IC1.H7(VSS_9) IC1.H8(VSS_10) IC1.H9(VSS_11) IC1.H10(VSS_12) IC1.H11(VDD_CORE_6) IC1.H12(VSS_13) IC1.H13(VDD_MPU_6) IC1.H14(VDDSHV4_1) IC1.H15(VDDS_PLL_MPU) IC1.H16(MII1_C0L) IC1.H17(MII1_CRS) IC1.H18(RMII1_REF_CLK) IC1.J5(VDDS_DDR_5) IC1.J6(VSS_14) IC1.J7(VSS_15) IC1.J8(VSS_16) IC1.J9(VSS_17) IC1.J10(VSS_18) IC1.J11(VSS_19) IC1.J12(VDD_CORE_7) IC1.J13(VDD_MPU_7) IC1.J14(VDDSHV4_2) IC1.J15(MII1_RX_ER) IC1.J16(MII1_TX_EN) IC1.J17(MII1_RX_DV) IC1.J18(MII1_TXD3) IC1.K5(VDDS_DDR_6) IC1.K6(VDD_CORE_8) IC1.K7(VSS_20) IC1.K8(VDD_CORE_9) IC1.K9(VSS_21) IC1.K10(VSS_22) IC1.K11(VSS_23) IC1.K12(VDD_CORE_10) IC1.K13(VDDS_4) IC1.K14(VDDSHV5_1) IC1.K15(MII1_TXD2) IC1.K16(MII1_TXD1) IC1.K17(MII1_TXD0) IC1.K18(MII1_TX_CLK) IC1.L1(DDR_DQS1) IC1.L2(DDR_DQSN1) IC1.L5(VDDS_DDR_7) IC1.L6(VDD_CORE_11) IC1.L7(VDD_CORE_12) IC1.L8(VDD_CORE_13) IC1.L9(VDD_CORE_14) IC1.L10(VSS_24) IC1.L11(VSS_25) IC1.L12(VSS_26) IC1.L13(VSS_27) IC1.L14(VDDSHV5_2) IC1.L15(MII1_RXD1) IC1.L16(MII1_RXD2) IC1.L17(MII1_RXD3) IC1.L18(MII1_RX_CLK) IC1.M5(VPP) IC1.M6(VSS_28) IC1.M7(VSS_29) IC1.M8(VSS_30) IC1.M9(VSS_31) IC1.M10(VSS_32) IC1.M11(VDD_CORE_15) IC1.M12(VSS_33) IC1.M13(VDD_CORE_16) IC1.M14(VSSA_USB_1) IC1.M15(USB0_CE) IC1.M16(MII1_RXD0) IC1.M17(MDIO) IC1.M18(MDC) IC1.N5(VDDSHV6_7) IC1.N6(VDDS_5) IC1.N7(VSS_34) IC1.N8(VDD_CORE_17) IC1.N9(VDD_CORE_18) IC1.N10(VSS_35) IC1.N11(VSS_36) IC1.N12(VDD_CORE_19) IC1.N13(VDD_CORE_20) IC1.N14(VSSA_USB_2) IC1.N15(VDDA3P3V_USB0) IC1.N16(VDDA1P8V_USB0) IC1.N17(USB0_DP) IC1.N18(USB0_DM) IC1.P5(VDDSHV6_8) IC1.P6(VDDSHV6_9) IC1.P7(VDDSHV1_1) IC1.P8(VDDSHV1_2) IC1.P9(VDDS_6) IC1.P10(VDDSHV2_1) IC1.P11(VDDSHV2_2) IC1.P12(VDDSHV3_1) IC1.P13(VDDSHV3_2) IC1.P14(VDDS_7) IC1.P15(USBO_VBUS) IC1.P16(USB0_ID) IC1.P17(USB1_ID) IC1.P18(USB1_CE) IC1.R7(GPMC_ADVN_ALE) IC1.R8(GPMC_AD2) IC1.R9(GPMC_AD6) IC1.R10(VDDS_PLL_CORE_LCD) IC1.R11(VDDS_OSC) IC1.R13(GPMC_A0) IC1.R14(GPMC_A4) IC1.R15(VDDA3P3V_USB1) IC1.R16(VDDA1P8V_USB1) IC1.R17(USB1_DP) IC1.R18(USB1_DM) IC1.T6(GPMC_BEN0_CLE) IC1.T7(GPMC_OEN_REN) IC1.T8(GPMC_AD3) IC1.T9(GPMC_AD7) IC1.T13(GPMC_CSN3) IC1.T14(GPMC_A3) IC1.T15(GPMC_A7) IC1.T16(GPMC_A10) IC1.T17(GPMC_WAIT0) IC1.T18(USB1_VBUS) IC1.U6(GPMC_WEN) IC1.U7(GPMC_AD0) IC1.U8(GPMC_AD4) IC1.U9(GPMC_CSN1) IC1.U11(XTALOUT) IC1.U14(GPMC_A2) IC1.U15(GPMC_A6) IC1.U16(GPMC_A9) IC1.U17(GPMC_WPN) IC1.U18(GPMC_BEN1) IC1.V1(VSS_37) IC1.V6(GPMC_CSN0) IC1.V7(GPMC_AD1) IC1.V8(GPMC_AD5) IC1.V9(GPMC_CSN2) IC1.V10(XTALIN) IC1.V11(VSS_OSC) IC1.V14(GPMC_A1) IC1.V15(GPMC_A5) IC1.V16(GPMC_A8) IC1.V17(GPMC_A11) IC1.V18(VSS_38) J2.35 J2.37 J2.38 J2.39 J2.40 J3.5 J3.6 J4.7 JP1.1 JP1.2 JP1.3 JP1.4 JP2.1 JP2.2 JP2.3 JP2.4 JP3.1 JP3.2 JP3.3 JP3.4 U$1.E2(E2-NC)

## Notes on the sheet
- 3.3v power supply | 5v power supply
- 5V Voltage Regulator
- 5V Voltage Regulator
- 3V to 40V DC
- 3.3V, 500mA
- 3V to 40V DC
- Vref = 1.25V | 5V, 1500mA
- Vref = 1.25V
- 3.3v power supply | 9.6v power supply
- 5V Voltage Regulator
- 5V Voltage Regulator
- 3V to 40V DC
- 5V, 1500mA
- 3V to 40V DC
- 3.3V, 500mA
- Vref = 1.25V
- Vref = 1.25V
- debugger
- 3.3v power supply | 12v power supply
- storage
  MOLEX 1040310811
- 5V Voltage Regulator
- 5V Voltage Regulator
- 3V to 40V DC
- 3V to 40V DC | 5V, 1500mA
- 3.3V, 500mA
- Vref = 1.25V
- memory
  IS42S16160G
- Vref = 1.25V
- TFT DISPLAY
  NHD-7.0-800480EF-ASXV#-T
- Led
- processor
  AM3358BZCZ100
- GPIO

## Library data of the parts
C1-C20 = rcl:C-EU: CAPACITOR, European symbol
D1-D12 = diode:DIODE-: DIODE
DISPLAY_POWER PS1-PS4 = pinhead:PINHD-1X2: PIN HEADER
IC1 = AM3358BZCZ100:AM3358BZCZ100: Sitara processor: Arm Cortex-A8, 3D graphics, PRU-ICSS, CAN Source: Datasheet <http://uk.rs-online.com/web/p/products/8176442P>; DESCRIPTION: <p>Sitara processor: Arm Cortex-A8, 3D graphics, PRU-ICSS, CAN</p>; HEIGHT: 1.4mm; MANUFACTURER_NAME: Texas Instruments; MANUFACTURER_PART_NUMBER: AM3358BZCZ100; RS_PART_NUMBER: 8176442P; RS_PRICE-STOCK: http://uk.rs-online.com/web/p/products/8176442P
IC2-IC7 = v-reg:LM317?*: 500 mA Adjustable Output Positive Voltage Regulator Source: http://www.onsemi.co.jp .. LM317M-D.PDF
J1 = 1040310811:1040310811: MICRO SD card socket, push-pull 1.42H Normal type Source: Datasheet <http://www.molex.com/pdm_docs/sd/1040310811_sd.pdf>; DESCRIPTION: MICRO SD card socket, push-pull 1.42H Normal type; HEIGHT: mm; MANUFACTURER_NAME: Molex; MANUFACTURER_PART_NUMBER: 1040310811; MOUSER_PART_NUMBER: N/A; MOUSER_PRICE-STOCK: https://www.mouser.com/Search/Refine.aspx?Keyword=N%2FA
J2 = 54104-4031:54104-4031: Connector 0.5mm, FFC/FPC, SMT,r/a,40w,Au Molex FFC/FPC SMT Series 0.5mm Pitch 40 Way Right Angle SMT Female FPC Connector, ZIF Top Contact Source: Datasheet <https://componentsearchengine.com/Datasheets/1/54104-4031.pdf>; DESCRIPTION: Connector 0.5mm, FFC/FPC, SMT,r/a,40w,Au Molex FFC/FPC SMT Series 0.5mm Pitch 40 Way Right Angle SMT Female FPC Connector, ZIF Top Contact; HEIGHT: mm; MANUFACTURER_NAME: Molex; MANUFACTURER_PART_NUMBER: 54104-4031; MOUSER_PART_NUMBER: 538-54104-4031; MOUSER_PRICE-STOCK: https://www.mouser.com/Search/Refine.aspx?Keyword=538-54104-4031
J3 = 200529-0040:200529-0040: MOLEX - 200529-0040. - CONNECTOR, FFC/FPC, ZIF, 4POS, 1MM Source: Datasheet <https://componentsearchengine.com/Datasheets/1/200529-0040.pdf>; DESCRIPTION: MOLEX - 200529-0040. - CONNECTOR, FFC/FPC, ZIF, 4POS, 1MM; HEIGHT: 2mm; MANUFACTURER_NAME: Molex; MANUFACTURER_PART_NUMBER: 200529-0040; MOUSER_PART_NUMBER: 538-200529-0040; MOUSER_PRICE-STOCK: https://www.mouser.com/Search/Refine.aspx?Keyword=538-200529-0040
J4 = M50-3610542R:M50-3610542R: HARWIN - M50-3610542R - CONNECTOR, HEADER, 10POS, 2ROW, 1.27MM Source: Datasheet <https://cdn.harwin.com/pdfs/M50-361.pdf>; DESCRIPTION: HARWIN - M50-3610542R - CONNECTOR, HEADER, 10POS, 2ROW, 1.27MM; HEIGHT: 5.03mm; MANUFACTURER_NAME: HARWIN; MANUFACTURER_PART_NUMBER: M50-3610542R; MOUSER_PART_NUMBER: 855-M50-3610542R; MOUSER_PRICE-STOCK: https://www.mouser.com/Search/Refine.aspx?Keyword=855-M50-3610542R
JP1-JP3 = pinhead:PINHD-1X4: PIN HEADER
R1 R2 R5-R24 = rcl:R-EU_: RESISTOR, European symbol; SPICEPREFIX: R
U$1 = IS42s1610g-5bl:IS42S1610G-5BL

## Board
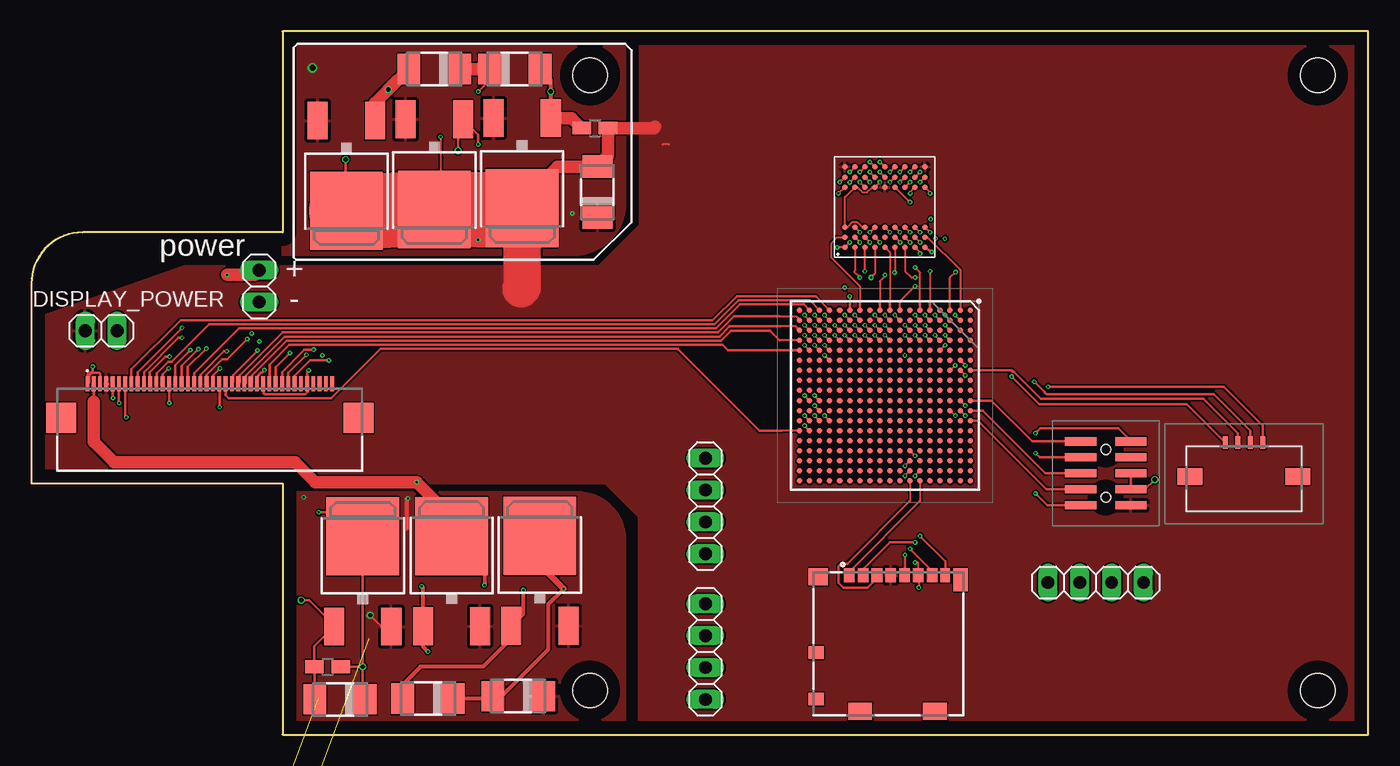
[diagram p9: board, top side]
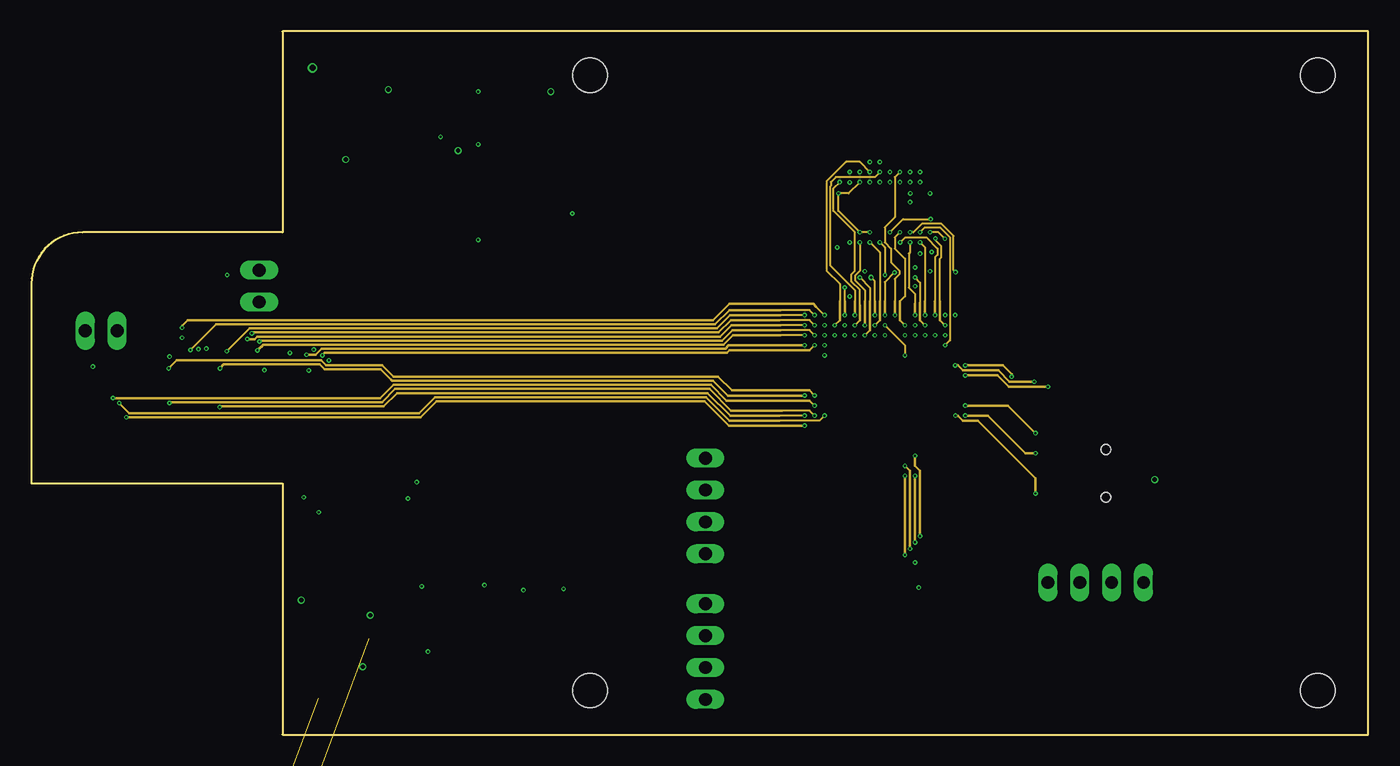
[diagram p10: board, inner layer Route2]
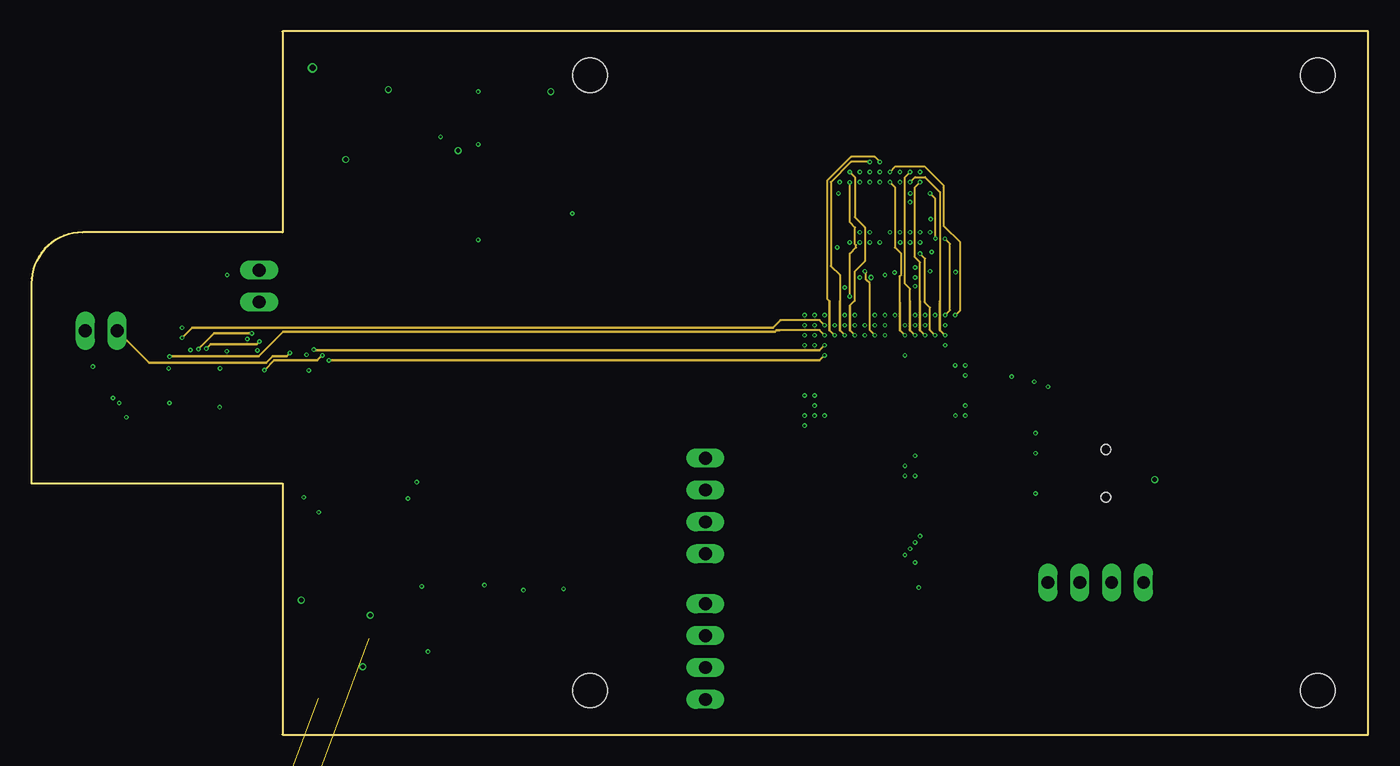
[diagram p11: board, inner layer Route15]
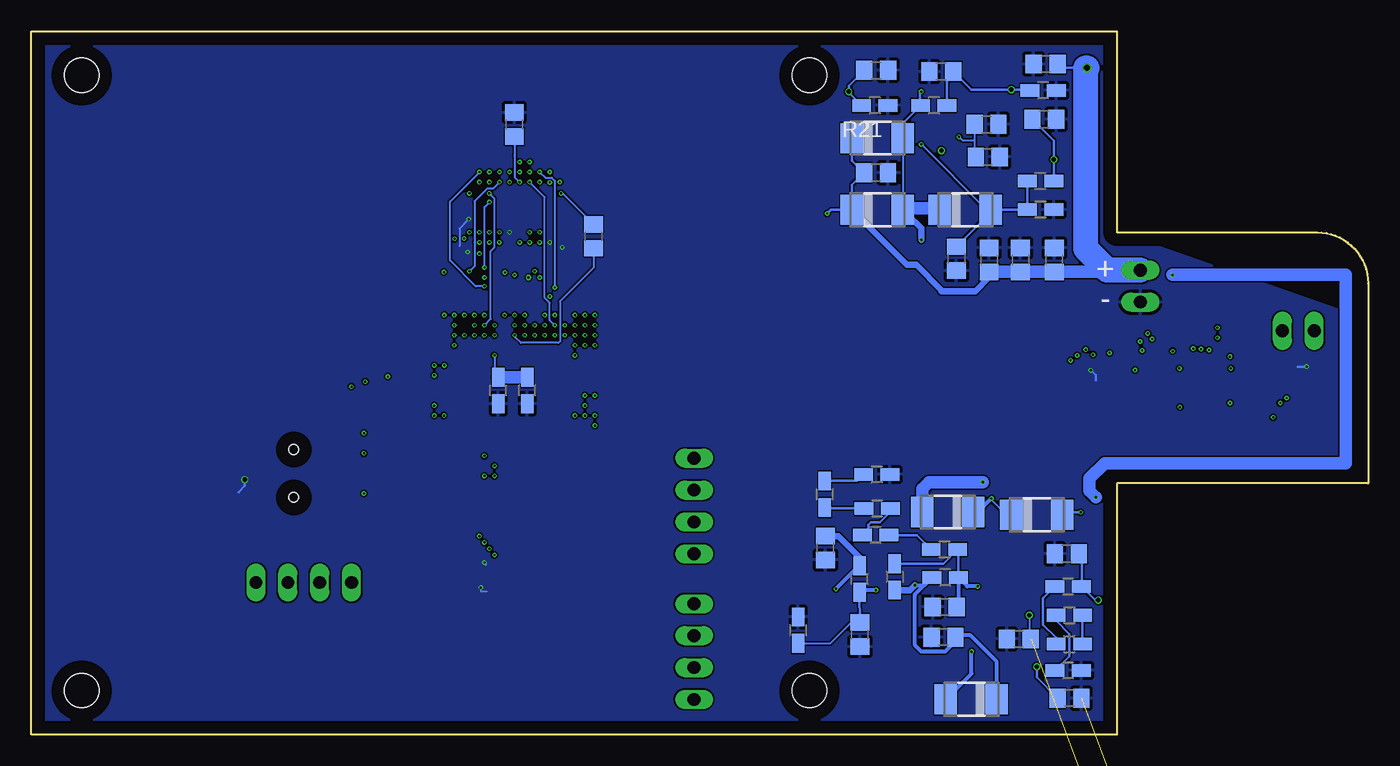
[diagram p12: board, bottom side, seen from below]

Size 106.5 x 56 mm. Coordinates in mm from the lower left corner, seen from the top.
Outline: 0,20 20,20 20,0 106.5,0 106.5,56 20,56 20,40 4.07,40 arc90 0,35.93 0,20
Copper layers (1+2*15+16): Top 0.035mm / dielectric 1.5mm / Route2 0.035mm / dielectric 0.15mm / Route15 0.035mm / dielectric 0.2mm / Bottom 0.035mm
Design rules "default *": minimum track width 0.125mm, minimum drill 0.125mm, track to track 0.125mm, track to pad 0.125mm, pad to pad 0.125mm, via to via 0.15mm, smd to smd 0.125mm, copper to edge 40mil, drill to drill 0.2mm, minimum pad ring 0.1mm, minimum via ring 0.1mm, stop-mask expansion 0mil, vias tented up to drill 0mil, thermal gap 10mil
Holes 2.75 mm at 102.5,3.5 44.5,3.5 44.5,52.5 102.5,52.5

### Footprints (pad centres in the part's own frame; a part is rotated, then mirrored left to right if it is on the bottom)
C0805 = smd 1.3 x 1.5: 1 -0.95,0; 2 0.95,0
DO-214AC = smd 1.8 x 2.4: A 2.025,0; C -2.025,0
1X02 = drill 1.016 long: 1 -1.27,0; 2 1.27,0
BGA324C80P18X18_1500X1500X140 = smd 0.45 x 0.45: A1 -6.8,6.8; A2 -6,6.8; A3 -5.2,6.8; A4 -4.4,6.8; A5 -3.6,6.8; A6 -2.8,6.8; A7 -2,6.8; A8 -1.2,6.8; A9 -0.4,6.8; A10 0.4,6.8; A11 1.2,6.8; A12 2,6.8; A13 2.8,6.8; A14 3.6,6.8; A15 4.4,6.8; A16 5.2,6.8; A17 6,6.8; A18 6.8,6.8; B1 -6.8,6; B2 -6,6; B3 -5.2,6; B4 -4.4,6; B5 -3.6,6; B6 -2.8,6; B7 -2,6; B8 -1.2,6; B9 -0.4,6; B10 0.4,6; B11 1.2,6; B12 2,6; B13 2.8,6; B14 3.6,6; B15 4.4,6; B16 5.2,6; B17 6,6; B18 6.8,6; C1 -6.8,5.2; C2 -6,5.2; C3 -5.2,5.2; C4 -4.4,5.2; C5 -3.6,5.2; C6 -2.8,5.2; C7 -2,5.2; C8 -1.2,5.2; C9 -0.4,5.2; C10 0.4,5.2; C11 1.2,5.2; C12 2,5.2; C13 2.8,5.2; C14 3.6,5.2; C15 4.4,5.2; C16 5.2,5.2; C17 6,5.2; C18 6.8,5.2; D1 -6.8,4.4; D2 -6,4.4; D3 -5.2,4.4; D4 -4.4,4.4; D5 -3.6,4.4; D6 -2.8,4.4; D7 -2,4.4; D8 -1.2,4.4; D9 -0.4,4.4; D10 0.4,4.4; D11 1.2,4.4; D12 2,4.4; D13 2.8,4.4; D14 3.6,4.4; D15 4.4,4.4; D16 5.2,4.4; D17 6,4.4; D18 6.8,4.4; E1 -6.8,3.6; E2 -6,3.6; E3 -5.2,3.6; E4 -4.4,3.6; E5 -3.6,3.6; E6 -2.8,3.6; E7 -2,3.6; E8 -1.2,3.6; E9 -0.4,3.6; E10 0.4,3.6; E11 1.2,3.6; E12 2,3.6; E13 2.8,3.6; E14 3.6,3.6; E15 4.4,3.6; E16 5.2,3.6; E17 6,3.6; E18 6.8,3.6; F1 -6.8,2.8; F2 -6,2.8; F3 -5.2,2.8; F4 -4.4,2.8; F5 -3.6,2.8; F6 -2.8,2.8; F7 -2,2.8; F8 -1.2,2.8; F9 -0.4,2.8; F10 0.4,2.8; F11 1.2,2.8; F12 2,2.8; F13 2.8,2.8; F14 3.6,2.8; F15 4.4,2.8; F16 5.2,2.8; F17 6,2.8; F18 6.8,2.8; G1 -6.8,2; G2 -6,2; G3 -5.2,2; G4 -4.4,2; G5 -3.6,2; G6 -2.8,2; G7 -2,2; G8 -1.2,2; G9 -0.4,2; G10 0.4,2; G11 1.2,2; G12 2,2; G13 2.8,2; G14 3.6,2; G15 4.4,2; G16 5.2,2; G17 6,2; G18 6.8,2; H1 -6.8,1.2; H2 -6,1.2; H3 -5.2,1.2; H4 -4.4,1.2; H5 -3.6,1.2; H6 -2.8,1.2; H7 -2,1.2; H8 -1.2,1.2; H9 -0.4,1.2; H10 0.4,1.2; H11 1.2,1.2; H12 2,1.2; H13 2.8,1.2; H14 3.6,1.2; H15 4.4,1.2; H16 5.2,1.2; H17 6,1.2; H18 6.8,1.2; J1 -6.8,0.4; J2 -6,0.4; J3 -5.2,0.4; J4 -4.4,0.4; J5 -3.6,0.4; J6 -2.8,0.4; J7 -2,0.4; J8 -1.2,0.4; J9 -0.4,0.4; J10 0.4,0.4; J11 1.2,0.4; J12 2,0.4; J13 2.8,0.4; J14 3.6,0.4; J15 4.4,0.4; J16 5.2,0.4; J17 6,0.4; J18 6.8,0.4; K1 -6.8,-0.4; K2 -6,-0.4; K3 -5.2,-0.4; K4 -4.4,-0.4; K5 -3.6,-0.4; K6 -2.8,-0.4; K7 -2,-0.4; K8 -1.2,-0.4; K9 -0.4,-0.4; K10 0.4,-0.4; K11 1.2,-0.4; K12 2,-0.4; K13 2.8,-0.4; K14 3.6,-0.4; K15 4.4,-0.4; K16 5.2,-0.4; K17 6,-0.4; K18 6.8,-0.4; L1 -6.8,-1.2; L2 -6,-1.2; L3 -5.2,-1.2; L4 -4.4,-1.2; L5 -3.6,-1.2; L6 -2.8,-1.2; L7 -2,-1.2; L8 -1.2,-1.2; L9 -0.4,-1.2; L10 0.4,-1.2; L11 1.2,-1.2; L12 2,-1.2; L13 2.8,-1.2; L14 3.6,-1.2; L15 4.4,-1.2; L16 5.2,-1.2; L17 6,-1.2; L18 6.8,-1.2; M1 -6.8,-2; M2 -6,-2; M3 -5.2,-2; M4 -4.4,-2; M5 -3.6,-2; M6 -2.8,-2; M7 -2,-2; M8 -1.2,-2; M9 -0.4,-2; M10 0.4,-2; M11 1.2,-2; M12 2,-2; M13 2.8,-2; M14 3.6,-2; M15 4.4,-2; M16 5.2,-2; M17 6,-2; M18 6.8,-2; N1 -6.8,-2.8; N2 -6,-2.8; N3 -5.2,-2.8; N4 -4.4,-2.8; N5 -3.6,-2.8; N6 -2.8,-2.8; N7 -2,-2.8; N8 -1.2,-2.8; N9 -0.4,-2.8; N10 0.4,-2.8; N11 1.2,-2.8; N12 2,-2.8; N13 2.8,-2.8; N14 3.6,-2.8; N15 4.4,-2.8; N16 5.2,-2.8; N17 6,-2.8; N18 6.8,-2.8; P1 -6.8,-3.6; P2 -6,-3.6; P3 -5.2,-3.6; P4 -4.4,-3.6; P5 -3.6,-3.6; P6 -2.8,-3.6; P7 -2,-3.6; P8 -1.2,-3.6; P9 -0.4,-3.6; P10 0.4,-3.6; P11 1.2,-3.6; P12 2,-3.6; P13 2.8,-3.6; P14 3.6,-3.6; P15 4.4,-3.6; P16 5.2,-3.6; P17 6,-3.6; P18 6.8,-3.6; R1 -6.8,-4.4; R2 -6,-4.4; R3 -5.2,-4.4; R4 -4.4,-4.4; R5 -3.6,-4.4; R6 -2.8,-4.4; R7 -2,-4.4; R8 -1.2,-4.4; R9 -0.4,-4.4; R10 0.4,-4.4; R11 1.2,-4.4; R12 2,-4.4; R13 2.8,-4.4; R14 3.6,-4.4; R15 4.4,-4.4; R16 5.2,-4.4; R17 6,-4.4; R18 6.8,-4.4; T1 -6.8,-5.2; T2 -6,-5.2; T3 -5.2,-5.2; T4 -4.4,-5.2; T5 -3.6,-5.2; T6 -2.8,-5.2; T7 -2,-5.2; T8 -1.2,-5.2; T9 -0.4,-5.2; T10 0.4,-5.2; T11 1.2,-5.2; T12 2,-5.2; T13 2.8,-5.2; T14 3.6,-5.2; T15 4.4,-5.2; T16 5.2,-5.2; T17 6,-5.2; T18 6.8,-5.2; U1 -6.8,-6; U2 -6,-6; U3 -5.2,-6; U4 -4.4,-6; U5 -3.6,-6; U6 -2.8,-6; U7 -2,-6; U8 -1.2,-6; U9 -0.4,-6; U10 0.4,-6; U11 1.2,-6; U12 2,-6; U13 2.8,-6; U14 3.6,-6; U15 4.4,-6; U16 5.2,-6; U17 6,-6; U18 6.8,-6; V1 -6.8,-6.8; V2 -6,-6.8; V3 -5.2,-6.8; V4 -4.4,-6.8; V5 -3.6,-6.8; V6 -2.8,-6.8; V7 -2,-6.8; V8 -1.2,-6.8; V9 -0.4,-6.8; V10 0.4,-6.8; V11 1.2,-6.8; V12 2,-6.8; V13 2.8,-6.8; V14 3.6,-6.8; V15 4.4,-6.8; V16 5.2,-6.8; V17 6,-6.8; V18 6.8,-6.8
DPACK = smd 1.6 x 3: 1 -2.28,-4.8; 3 2.28,-4.8 | smd 5.8 x 6.2: 4 0,2.38
1040310811 = smd 0.85 x 1.1: 1 3.105,0.25; 2 2.005,0.25; 3 0.905,0.25; 4 -0.195,0.25; 5 -1.295,0.25; 6 -2.395,0.25; 7 -3.495,0.25 | smd 0.75 x 1.1: 8 -4.545,0.25 | smd 1.17 x 1.8: 9 -5.755,0.6 | smd 1.9 x 1.35: 10 -3.73,11.075; 11 2.24,11.075 | smd 1.2 x 1: 12 5.74,10.1; 13 5.74,6.4 | smd 1.55 x 1.35: 14 5.565,0.375
54104-4031 = smd 0.3 x 1.2: 1 -9.75,0.382; 2 -9.25,0.382; 3 -8.75,0.382; 4 -8.25,0.382; 5 -7.75,0.382; 6 -7.25,0.382; 7 -6.75,0.382; 8 -6.25,0.382; 9 -5.75,0.382; 10 -5.25,0.382; 11 -4.75,0.382; 12 -4.25,0.382; 13 -3.75,0.382; 14 -3.25,0.382; 15 -2.75,0.382; 16 -2.25,0.382; 17 -1.75,0.382; 18 -1.25,0.382; 19 -0.75,0.382; 20 -0.25,0.382; 21 0.25,0.382; 22 0.75,0.382; 23 1.25,0.382; 24 1.75,0.382; 25 2.25,0.382; 26 2.75,0.382; 27 3.25,0.382; 28 3.75,0.382; 29 4.25,0.382; 30 4.75,0.382; 31 5.25,0.382; 32 5.75,0.382; 33 6.25,0.382; 34 6.75,0.382; 35 7.25,0.382; 36 7.75,0.382; 37 8.25,0.382; 38 8.75,0.382; 39 9.25,0.382; 40 9.75,0.382 | smd 2.4 x 2.4: 41 -11.85,-2.318; 42 11.85,-2.318
2005290040 = smd 0.4 x 1: 1 -1.5,2.475; 2 -0.5,2.475; 3 0.5,2.475; 4 1.5,2.475 | smd 2 x 1.3: 5 -4.3,-0.225; 6 4.3,-0.225
M503610542 = smd 0.65 x 2.5: 1 -2.54,-2; 2 -2.54,2; 3 -1.27,-2; 4 -1.27,2; 5 0,-2; 6 0,2; 7 1.27,-2; 8 1.27,2; 9 2.54,-2; 10 2.54,2 | hole 0.8: -1.905,0; 1.905,0
1X04 = drill 1.016 long: 1 -3.81,0; 2 -1.27,0; 3 1.27,0; 4 3.81,0
R0805W = smd 1.5 x 1: 1 -1.052,0; 2 1.052,0
TF-BGA54 = smd 0.45 x 0.45: A1 0.8,7.2; A2 1.6,7.2; A3 2.4,7.2; A7 5.6,7.2; A8 6.4,7.2; A9 7.2,7.2; B1 0.8,6.4; B2 1.6,6.4; B3 2.4,6.4; B7 5.6,6.4; B8 6.4,6.4; B9 7.2,6.4; C1 0.8,5.6; C2 1.6,5.6; C3 2.4,5.6; C7 5.6,5.6; C8 6.4,5.6; C9 7.2,5.6; D1 0.8,4.8; D2 1.6,4.8; D3 2.4,4.8; D7 5.6,4.8; D8 6.4,4.8; D9 7.2,4.8; E1 0.8,4; E2 1.6,4; E3 2.4,4; E7 5.6,4; E8 6.4,4; E9 7.2,4; F1 0.8,3.2; F2 1.6,3.2; F3 2.4,3.2; F7 5.6,3.2; F8 6.4,3.2; F9 7.2,3.2; G1 0.8,2.4; G2 1.6,2.4; G3 2.4,2.4; G7 5.6,2.4; G8 6.4,2.4; G9 7.2,2.4; H1 0.8,1.6; H2 1.6,1.6; H3 2.4,1.6; H7 5.6,1.6; H8 6.4,1.6; H9 7.2,1.6; J1 0.8,0.8; J2 1.6,0.8; J3 2.4,0.8; J7 5.6,0.8; J8 6.4,0.8; J9 7.2,0.8

### Placement (x,y rotation side)
C1  39.21,44.74 0 bottom
C2  43.24,14.86 270 bottom
C3  40.5,7.96 270 bottom
C4  61.71,39.68 90 bottom
C5  68.02,48.59 270 bottom
C6  27.83,7.61 180 bottom
C7  33.83,7.76 180 bottom
C8  33.74,10.16 180 bottom
C9  25,37.8 90 bottom
C10  23.8,2.9 0 bottom
C11  24,14.4 180 bottom
C12  27.7,37.8 90 bottom
C13  30.3,46 0 bottom
C14  32.8,37.9 270 bottom
C15  30.2,37.8 90 bottom
C16  30.4,48.6 0 bottom
C17  39.2,52.9 0 bottom
C18  25.7,53.4 180 bottom
C19  25.8,49 0 bottom
C20  34,52.8 180 bottom
D1  31.62,2.81 180 bottom
D2  31.6,2.87 180 top
D3  38.78,3.06 180 top
D4  33.49,17.72 180 bottom
D5  24.6,2.8 180 top
D6  26.4,17.5 0 bottom
D7  32.1,41.8 0 bottom
D8  39.1,47.5 0 bottom
D9  38.5,53 0 top
D10  39.1,41.8 0 bottom
D11  32.1,53 180 top
D12  45.1,43.2 90 top
DISPLAY_POWER  5.56,32.16 0 top
IC1  68,27 270 top
IC2  33.48,13.42 0 top
IC3  40.51,13.46 0 top
IC4  26.4,13.4 0 top
IC5  32.1,44.2 180 top
IC6  39.1,44.3 180 top
IC7  25.1,44.1 180 top
J1  68.27,12.93 180 top
J2  14.22,27.54 0 top
J3  96.61,20.77 0 top
J4  85.6,20.8 90 top
JP1  53.7,18.2 90 top
JP2  53.7,6.6 90 top
JP3  84.8,12.1 0 top
PS1  18.15,35.71 90 top
PS2  -16.54,-105.89 0 top  (outside the outline)
PS3  -16.54,-111.28 0 top  (outside the outline)
PS4  -16.54,-116.67 0 top  (outside the outline)
R1  40.51,12.39 90 bottom
R2  45.42,8.31 270 bottom
R5  39.23,15.89 180 bottom
R6  67,27.41 90 bottom
R7  69.31,27.4 90 bottom
R8  33.69,12.51 180 bottom
R9  39.12,18.01 0 bottom
R10  43.29,19.14 90 bottom
R11  37.71,12.56 270 bottom
R12  33.76,14.74 0 bottom
R13  39.14,20.71 180 bottom
R14  23.8,7.2 0 bottom
R15  23.6,5.4 0 top
R16  23.8,9.5 0 bottom
R17  23.9,5.1 180 bottom
R18  26.1,41.8 180 bottom
R19  23.9,11.8 0 bottom
R20  26.1,44.1 0 bottom
R21  39.3,50.1 180 bottom
R22  44.9,48.3 0 top
R23  25.9,51.3 180 bottom
R24  34.6,50.1 180 bottom
U$1  72,38 90 top

### Tracks (layer width: path | path; a pad name or v marks a point on that pad's centre or on a via)
DDR_A0  (via drill 0.15)
  Top 0.15: U$1.H7 70.03,43.23 v70.03,43.1
  Top 0.2: IC1.F3 v70.4,32.6
  Bottom 0.15: v70.4,32.6 69.9,33.1 69.9,38.5 69.6,38.8 69.6,42.67 v70.03,43.1
DDR_A1  (via drill 0.15)
  Top 0.15: U$1.H8 v70.8,44.8 | IC1.H1 69.2,34.5 v70.4,35.7
  Bottom 0.15: v70.4,35.7 71.1,35.7 73.16,37.76 73.16,42.44 v70.8,44.8
DDR_A2  (via drill 0.15)
  Top 0.15: v70.8,44 U$1.J8
  Top 0.2: IC1.E4 v71.2,31.8
  Route15 0.15: 70.8,34.5 70.8,37.6 70.4,38 70.4,43.6 v70.8,44
  Route15 0.2: v71.2,31.8 70.8,32.2 70.8,34.5
DDR_A3  (via drill 0.15)
  Top 0.15: U$1.J7 71.6,43.2 v71.6,43.1
  Top 0.2: IC1.C3 v72.8,32.6
  Route2 0.15: 72.4,34.5 72.4,37.9 72.5,38 72.5,38.9 72.03,39.38 v72.03,39.51
  Route2 0.2: v72.8,32.6 72.4,33 72.4,34.5
  Route15 0.15: v72.03,39.51 72.03,42.67 v71.6,43.1
DDR_A4  (via drill 0.15)
  Top 0.15: U$1.J3 v71.6,40
  Top 0.2: IC1.C2 v72.8,33.4
  Route2 0.15: v72.78,39.48 72.27,40 v71.6,40
  Route15 0.15: v72.8,33.4 73.2,33.8 73.2,39.07 v72.78,39.48
DDR_A5
  Top 0.15: IC1.B1 74,37 71.4,39.6 U$1.J2
DDR_A6  (via drill 0.15)
  Top 0.15: U$1.H3 v70.8,40
  Top 0.2: IC1.D5 v72.8,31
  Route2 0.15: 73.2,31.4 73.2,39.6 72.4,40.4 71.2,40.4 v70.8,40
  Route2 0.2: v72.8,31 73.2,31.4
DDR_A7  (via drill 0.15)
  Top 0.15: U$1.H2 v70.8,39.2
  Top 0.2: IC1.E2 v71.2,33.4
  Route2 0.15: v70.8,39.2 71.2,38.8 71.2,34.5
  Route2 0.2: 71.2,34.5 v71.2,33.4
DDR_A8  (via drill 0.15)
  Top 0.15: U$1.H1 70.8,38.4 v70.8,38.3
  Top 0.2: IC1.D4 v72,31.8
  Route15 0.15: v70.8,38.3 71.2,37.9 71.2,34.4 71.6,34 71.6,32.2
  Route15 0.152: v72,31.8 71.6,32.2
DDR_A9  (via drill 0.15)
  Top 0.15: v70,40 U$1.G3 | IC1.C1 73.2,36.4 v73.62,36.83
  Route2 0.15: v73.62,36.83 73.47,36.98 73.47,39.71 72.51,40.67 70.94,40.67 70.27,40 v70,40
DDR_A10  (via drill 0.15)
  Top 0.15: v70,44.8 U$1.H9
  Top 0.2: IC1.F4 v70.4,31.8
  Route15 0.15: 70,34.5 70,35.5 69.6,35.9 69.6,44.4 v70,44.8
  Route15 0.2: v70.4,31.8 70,32.2 70,34.5
DDR_A11  (via drill 0.15)
  Top 0.15: U$1.G2 v70,39.2
  Top 0.2: IC1.F2 v70.4,33.4
  Route2 0.15: v70,39.2 70,38.4 69.9,38.3 69.9,35.6 70.4,35.1 70.4,34.3
  Route2 0.2: v70.4,33.4 70.4,34.3
DDR_A12  (via drill 0.15)
  Top 0.15: U$1.G1 69.6,36.9 70.1,36.4 v70.4,36.4
  Top 0.2: IC1.E3 v71.2,32.6
  Route2 0.15: v70.4,36.4 70.8,36 70.8,34.4
  Route2 0.2: v71.2,32.6 70.8,33 70.8,34.4
DDR_BA0  (via drill 0.15)
  Top 0.15: U$1.G7 v70,44
  Top 0.2: IC1.C4 v72.8,31.8
  Route15 0.15: 72.4,34.5 72.4,43.2 71.2,44.4 70.4,44.4 v70,44
  Route15 0.2: v72.8,31.8 72.4,32.2 72.4,34.5
DDR_BA1  (via drill 0.15)
  Top 0.15: U$1.G8 v69.2,44 | v71.6,36.9 71.6,34.5
  Top 0.2: IC1.E1 71.6,34.5
  Bottom 0.15: v69.2,44 69.72,43.48 70.18,43.48 71.2,42.45 71.2,39.2 71.2,37.3 v71.6,36.9
DDR_CASN  (via drill 0.15)
  Top 0.15: 70.8,34.5 70.8,36.8 v70.4,37.2 | v70,42.4 U$1.F7
  Top 0.2: IC1.F1 70.8,34.5
  Bottom 0.15: v70.4,37.2 70.4,42 v70,42.4
DDR_CK  (via drill 0.15)
  Top 0.15: U$1.F2 68.82,39.6 v69.22,39.2
  Top 0.2: IC1.D2 v72,33.4
  Route2 0.15: v69.22,39.2 69.62,39.6 71.3,39.6 72.2,38.7 72.2,38.2 72,38 72,34.5
  Route2 0.2: 72,34.5 v72,33.4
DDR_CKE  (via drill 0.15)
  Top 0.15: U$1.F3 v69.2,40
  Top 0.2: IC1.G3 v69.6,32.6
  Route2 0.15: v69.2,40 68.8,39.6 68.8,38.7 69.6,37.9 69.6,34.9 69.2,34.5
  Route2 0.2: v69.6,32.6 69.2,33 69.2,34.5
DDR_CSN0  (via drill 0.15)
  Top 0.15: U$1.G9 v69.2,44.8
  Top 0.2: IC1.H2 v68.8,33.4
  Route2 0.15: v69.2,44.8 68.8,44.4 68.8,41.2 68,40.4 68,39.2 68.5,38.7 68.5,37.6 69.15,36.95 69.15,36.65 68.8,36.3 68.8,34.5
  Route2 0.2: 68.8,34.5 v68.8,33.4
DDR_D0  (via drill 0.15)
  Top 0.15: v64.4,44 U$1.A8
  Top 0.2: IC1.M3 v65.6,32.6
  Route2 0.15: 66,34.2 66,35.41 65.35,36.06 65.35,36.67 65.6,36.92 65.6,40 63.9,41.7 63.9,43.5 v64.4,44
  Route2 0.2: v65.6,32.6 66,33 66,34.2
DDR_D1  (via drill 0.15)
  Top 0.15: U$1.B9 v65.2,44.8
  Top 0.2: IC1.M4 v65.6,31.8
  Route15 0.15: v65.2,44.8 65.6,44.4 65.6,41.2 66.4,40.4 66.4,37.7 65.58,36.88 65.58,34.55 65.2,34.17 65.2,34.1
  Route15 0.2: v65.6,31.8 65.2,32.2 65.2,34.1
DDR_D2  (via drill 0.15)
  Top 0.15: U$1.B8 65.2,44 v65.2,43.98 | v65.2,34.9 65.2,34.3
  Top 0.2: IC1.N1 65.2,34.3
  Route15 0.15: v65.2,43.98 65.2,40.8 65.62,40.38 65.62,39.05 65.7,38.97 65.7,38.8 65.2,38.3 v65.2,34.9
DDR_D3  (via drill 0.15)
  Top 0.15: U$1.C9 v66,44.8
  Top 0.2: IC1.N2 v64.8,33.4
  Route2 0.15: 64.8,34.5 v64.8,35.6
  Route2 0.2: v64.8,33.4 64.8,34.5
  Bottom 0.15: v66,44.8 65.55,44.35 65.05,44.35 64.8,44.11 v64.8,35.6
DDR_D4  (via drill 0.15)
  Top 0.15: U$1.C8 v66.8,44
  Top 0.2: IC1.N3 v64.8,32.6
  Bottom 0.15: v66.8,44 65.6,42.8 65.6,34.77 65.2,34.37 65.2,33 v64.8,32.6
DDR_D5  (via drill 0.15)
  Top 0.15: U$1.D9 v66.8,45.6
  Top 0.2: IC1.N4 v64.8,31.8
  Route15 0.15: v66.8,45.6 65.3,45.6 63.7,44 63.7,37.3 64.4,36.6 64.4,34.5
  Route15 0.2: v64.8,31.8 64.4,32.2 64.4,34.5
DDR_D6  (via drill 0.15)
  Top 0.15: U$1.D8 v66.8,44.8
  Top 0.2: IC1.P3 v64,32.6
  Route2 0.15: v66.8,44.8 66,45.6 64.9,45.6 63.35,44.05 63.35,36.95 64.4,35.9 64.4,34.5
  Route2 0.2: v64,32.6 64.4,33 64.4,34.5
DDR_D7  (via drill 0.15)
  Top 0.15: U$1.E9 v67.6,45.6
  Top 0.2: IC1.P4 v64,31.8
  Route15 0.15: v67.6,45.6 67.2,46 65.3,46 63.4,44.1 63.4,34.7 63.6,34.5
  Route15 0.2: v64,31.8 63.6,32.2 63.6,34.5
DDR_D8
  Top 0.15: U$1.E1 68.4,38.4 68.4,34.5
  Top 0.2: 68.4,34.5 IC1.J1
DDR_D9  (via drill 0.15)
  Top 0.15: U$1.D2 v67.6,39.2 | v68,36.6 68,36.5 67.6,36.1 67.6,34.5
  Top 0.2: 67.6,34.5 IC1.K1
  Route2 0.15: v67.6,39.2 68,38.8 v68,36.6
DDR_D10  (via drill 0.15, 0.2)
  Top 0.15: U$1.D1 67.2,36.7 v66.9,36.4
  Top 0.2: IC1.K2 v67.2,33.4
  Route2 0.15: 67.2,34.5 67.2,36.1 v66.9,36.4
  Route2 0.2: v67.2,33.4 67.2,34.5
DDR_D11  (via drill 0.15)
  Top 0.15: U$1.C2 v66.8,39.2
  Top 0.2: IC1.K3 v67.2,32.6
  Route2 0.15: v66.8,39.2 67.6,38.4 67.6,34.5
  Route2 0.2: v67.2,32.6 67.6,33 67.6,33.3 67.6,34.5
DDR_D12  (via drill 0.15)
  Top 0.15: IC1.K4 v67.2,31.8 | v66.4,36.9 U$1.C1
  Route15 0.15: v67.2,31.8 66.8,32.2 66.8,35.93 66.5,36.23 66.5,36.8 v66.4,36.9
DDR_D13  (via drill 0.15)
  Top 0.15: U$1.B2 v66,39.2
  Top 0.2: IC1.L3 v66.4,32.6
  Route2 0.15: v66,39.2 66,36.93 65.62,36.55 65.62,36.17 66.4,35.4 66.4,34.5
  Route2 0.2: 66.4,34.5 v66.4,32.6
DDR_D14  (via drill 0.15)
  Top 0.15: v66,36.4 65.54,36.86 65.6,36.92 U$1.B1
  Top 0.2: IC1.L4 v66.4,31.8
  Route2 0.15: v66,36.4 66.8,35.6 66.8,34.5
  Route2 0.2: v66.4,31.8 66.8,32.2 66.8,34.5
DDR_D15
  Top 0.15: 66,34.5 66,35.7 63.73,37.98 63.73,39.12 64.2,39.6 U$1.A2
  Top 0.2: 66,34.5 IC1.M1
DDR_DQM0  (via drill 0.15)
  Top 0.15: U$1.E8 v67.6,44.8
  Top 0.2: IC1.M2 v65.6,33.4
  Route2 0.15: 65.6,34.5 65.6,35.4 63.62,37.38 63.62,38.6 63.62,43.61 63.7,43.69 63.7,44 64.1,44.4 67.2,44.4 v67.6,44.8
  Route2 0.2: v65.6,33.4 65.6,34.5
DDR_DQM1  (via drill 0.15)
  Top 0.15: U$1.F1 68.8,36.83 v68.78,36.8
  Top 0.2: IC1.J2 v68,33.4
  Route2 0.15: v68.78,36.8 68,36.02 68,34.5
  Route2 0.2: 68,34.5 v68,33.4
DDR_RASN  (via drill 0.15)
  Top 0.15: U$1.F8 v68.4,44
  Top 0.2: IC1.G4 v69.6,31.8
  Route15 0.15: 69.2,34.4 69.2,36.53 69.3,36.63 69.3,38.3 68.8,38.8 68.8,43.6 v68.4,44
  Route15 0.2: v69.6,31.8 69.2,32.2 69.2,34.4
DDR_VREF  (via drill 0.15)
  Top 0.2: IC1.J4 v68,31.8
  Bottom 0.15: C4.1 61.71,37.19 64.4,34.5 64.4,31.3 64.5,31.2 67.5,31.2 68,31.7 v68,31.8
DDR_WEN  (via drill 0.15)
  Top 0.15: v68.4,44.8 U$1.F9
  Top 0.2: IC1.B2 v73.6,33.4
  Route15 0.15: v73.6,33.4 74,33.8 74,39.2 72.7,40.5 72.7,43.7 71.2,45.2 U$1.F9 v68.4,44.8
DISPLAY_POWER  (via drill 0.15)
  Top 0.2: J2.31 19.47,29.27 v20.6,30.4
  Route15 0.2: v20.6,30.4 20.32,30.12 19.21,30.12 18.69,29.6 9.39,29.6 DISPLAY_POWER.2
GND  (via drill 0.15, 0.35)  (3 unrouted)
  Top 0.15: v70.7,11.7 70.7,12.68 J1.6 70.67,13.7 v70.4,13.7 | v65.2,39.2 U$1.A1 v64.2,38.8 | U$1.E3 v68.4,40
  Top 0.2: U$1.J1 v71.73,38.43 | J2.29 18.5,27.89 18.5,27.2 18.6,27.1 21.8,27.1 22,27.3 22,27.89 J2.36 21.97,28.87 v22.1,29 | J2.3 5.47,28.73 5.4,28.8 4.6,28.8 4.5,28.7 4.5,27.95 J2.1 4.59,28.05 4.59,28.61 4.9,28.92 v4.9,29.3 | J4.5 J4.3 88.73,19.53 v89.5,20.3
  Route2 0.15: v68.4,40 69.45,41.05 v71.65,41.05
  Bottom 0.15: v70.7,11.7 70.7,11.4 70.2,11.4 | v70.4,13.7 70.3,13.7 70.3,13.5 | v71.65,41.05 72.4,40.3 72.4,38.9
  Bottom 0.2: v22.1,29 21.7,28.6 21.7,28.2 | v4.9,29.3 5.6,29.3 | v89.5,20.3 89.5,19.8 90,19.3
  pour Bottom: 0,33 0,20 20,20 20,0 106.5,0 106.5,56 20,56 20,40
JTAG_TCK
  Top 0.2: IC1.A12 75.4,25 80.87,19.53 J4.4
JTAG_TDI  (via drill 0.15)
  Top 0.2: IC1.B11 v74.4,25.4 | v80,22.4 80.33,22.07 J4.8
  Route2 0.2: v74.4,25.4 76.2,25.4 79.2,22.4 v80,22.4
JTAG_TDO
  Top 0.2: IC1.A11 75.8,25.8 80.8,20.8 J4.6
JTAG_TEST_RESET_NTRST  (via drill 0.15)
  Top 0.2: IC1.B10 v74.4,26.2 | v80,24 80.4,24.4 86.6,24.4 87.6,23.4 J4.9
  Route2 0.2: v74.4,26.2 77.8,26.2 v80,24
JTAG_TMS  (via drill 0.15)
  Top 0.2: IC1.C11 73.6,25.4 v73.62,25.4 | v80,19.2 80.94,18.26 J4.2
  Route2 0.2: v73.62,25.4 73.83,25.4 74.23,25 75.4,25 80,20.4 v80,19.2
LCD_AC_BIAS_EN  (via drill 0.15)
  Top 0.2: IC1.R6 v63.2,30.2 | v23.7,29.8 22.2,29.8 20.97,28.57 J2.34
  Route15 0.2: v63.2,30.2 62.8,29.8 v23.7,29.8
LCD_DATA0
  Top 0.15: IC1.R1 62.55,34.85
  Top 0.2: 62.55,34.85 62.48,34.92 56.21,34.92 54.28,33 11.88,33 7.97,29.09 J2.8
LCD_DATA1  (via drill 0.15)
  Top 0.15: IC1.R2 v63.2,33.4
  Top 0.2: J2.9 8.47,28.87 v12,32.4
  Route2 0.15: v63.2,33.4 62.52,34.08
  Route2 0.2: v12,32.4 12,32.55 12.45,33 54.3,33 55.6,34.3 62.3,34.3 62.52,34.08
LCD_DATA2  (via drill 0.15)
  Top 0.15: IC1.R3 v63.2,32.6
  Top 0.2: J2.10 8.97,28.87 11.7,31.6 v12,31.6
  Route15 0.15: v63.2,32.6 62.8,33 59.7,33
  Route15 0.2: 59.7,33 59.09,32.39 12.79,32.39 v12,31.6
LCD_DATA3  (via drill 0.15)
  Top 0.15: IC1.R4 v63.2,31.8
  Top 0.2: v11.01,30.09 10.65,30.09 9.43,28.87 9.43,27.96 J2.11
  Route15 0.15: v63.2,31.8 62.8,32.2 59.6,32.2
  Route15 0.2: 59.6,32.2 59.36,32.2 59.23,32.07 20.05,32.07 18.11,30.13 11.04,30.13 v11.01,30.09
LCD_DATA4
  Top 0.15: IC1.T1 62.02,34.58
  Top 0.2: 62.02,34.58 62,34.6 56.34,34.6 54.41,32.67 14.15,32.67 11.17,29.69 10.9,29.69 9.97,28.76 J2.12
LCD_DATA5  (via drill 0.15)
  Top 0.15: IC1.T2 v62.4,33.4
  Top 0.2: v12.67,30.63 11.47,29.43 J2.15
  Route2 0.15: v62.4,33.4 62,33.8 59.7,33.8
  Route2 0.2: 59.7,33.8 55.6,33.8 54.48,32.67 14.72,32.67 v12.67,30.63
LCD_DATA6  (via drill 0.15)
  Top 0.15: IC1.T3 v62.4,32.6
  Top 0.2: v13.31,30.69 11.97,29.36 J2.16
  Route2 0.15: v62.4,32.6 62,33 59.6,33
  Route2 0.2: 59.6,33 55.72,33 54.74,32.02 17.64,32.02 v17.56,31.95
  Route15 0.2: v17.56,31.95 14.56,31.95 v13.31,30.69
LCD_DATA7  (via drill 0.15)
  Top 0.15: IC1.T4 v62.4,31.8
  Top 0.2: v13.94,30.74 12.47,29.29 J2.17
  Route2 0.15: v62.4,31.8 62,32.2 59.7,32.2
  Route2 0.2: 59.7,32.2 55.84,32.2 55.01,31.38 18.24,31.38 v18.17,31.3
  Route15 0.2: v18.17,31.3 17.97,31.1 14.3,31.1 v13.94,30.74
LCD_DATA8
  Top 0.15: IC1.U1 61.55,34.25
  Top 0.2: 61.55,34.25 56.45,34.25 54.55,32.35 16.55,32.35 12.97,28.77 J2.18
LCD_DATA9  (via drill 0.15)
  Top 0.15: IC1.U2 v61.6,33.4
  Top 0.2: v15.57,30.53 15.33,30.53 13.47,28.67 J2.19
  Route2 0.15: v61.6,33.4 59.7,33.4
  Route2 0.2: 59.7,33.4 55.66,33.4 54.61,32.35 17.39,32.35 v15.57,30.53
LCD_DATA10  (via drill 0.15)
  Top 0.15: IC1.U3 v61.6,32.6
  Top 0.2: J2.20 13.97,28.67 15.2,29.9 15.6,29.9 v17.2,31.5
  Route2 0.15: v61.6,32.6 59.7,32.6
  Route2 0.2: 59.7,32.6 55.78,32.6 54.88,31.7 18,31.7 17.8,31.5 v17.2,31.5
LCD_DATA11  (via drill 0.15)
  Top 0.15: IC1.U4 v61.6,31.8
  Top 0.2: J2.24 16.09,28.05 16.09,28.61 18.01,30.53 v18.01,30.59
  Route2 0.15: v61.6,31.8 59.7,31.8
  Route2 0.2: 59.7,31.8 55.9,31.8 55.15,31.05 18.48,31.05 18.33,30.9 18.31,30.9 v18.01,30.59
LCD_DATA12
  Top 0.152: 59.6,33.3 60.9,33.3 IC1.V2
  Top 0.2: J2.25 16.59,28.05 16.59,28.61 20,32.02 54.69,32.02 55.96,33.3 59.6,33.3
LCD_DATA13
  Top 0.15: IC1.V3 60.9,32.5 59.7,32.5
  Top 0.2: 59.7,32.5 55.62,32.5 54.82,31.7 20.18,31.7 17.09,28.61 17.09,28.05 J2.26
LCD_DATA14
  Top 0.15: IC1.V4 59.6,31.4
  Top 0.2: 59.6,31.4 58.83,32.17 57.9,32.17 55.75,32.17 54.95,31.38 54,31.38 53.9,31.38 20.36,31.38 17.59,28.61 17.59,28.05 J2.27
LCD_DATA15  (via drill 0.15)
  Top 0.2: IC1.T5 v62.4,31 | v18.57,29.02 18.34,28.8 18.28,28.8 17.97,28.49 J2.28
  Route2 0.2: v62.4,31 62,30.6 55.62,30.6 55.42,30.4 23.38,30.4 v23.18,30.2
  Route15 0.2: v23.18,30.2 22.78,29.8 19.34,29.8 v18.57,29.02
LCD_DATA16  (via drill 0.15)
  Top 0.15: IC1.U13 v61.6,24.6
  Top 0.2: v7.57,25.27 7.47,25.36 J2.7
  Route2 0.2: v7.57,25.27 v7.58,25.27 31.02,25.27 32.3,26.55 53.61,26.55 55.56,24.6 v61.6,24.6
LCD_DATA17
  Top 0.15: IC1.V13 59.8,24.2
  Top 0.2: 59.8,24.2 58,24.2 51.5,30.7 51.5,30.73 27.84,30.73 23.89,26.77 15.73,26.77 15.47,27.03 J2.23
LCD_DATA18  (via drill 0.15)
  Top 0.15: IC1.R12 v63.2,25.4
  Top 0.2: v7,26.4 6.97,26.43 J2.6
  Route2 0.15: v63.2,25.4 62.8,25 59.6,25
  Route2 0.2: 59.6,25 55.62,25 53.75,26.88 32.6,26.88 32.2,26.88 32.16,26.88 30.89,25.6 7.8,25.6 v7,26.4
LCD_DATA19  (via drill 0.15)
  Top 0.15: IC1.T12 v62.4,25.4
  Top 0.2: v11,26.4 10.97,26.43 J2.14
  Route2 0.15: v62.4,25.4 62,25.8 59.8,25.8
  Route2 0.2: 59.8,25.8 55.74,25.8 54.02,27.52 28.98,27.52 27.93,26.48 11.07,26.48 v11,26.4
LCD_DATA20  (via drill 0.15)
  Top 0.15: IC1.U12 v61.6,25.4
  Top 0.2: v15,26.07 15,27.89 J2.22
  Route2 0.15: v61.6,25.4 59.6,25.4
  Route2 0.2: 59.6,25.4 55.68,25.4 53.88,27.2 29.12,27.2 28.07,26.15 15.07,26.15 v15,26.07
LCD_DATA21  (via drill 0.15)
  Top 0.15: IC1.T11 v62.4,26.2
  Top 0.2: v6.5,26.8 6.47,26.83 J2.5
  Route2 0.2: v62.4,26.2 62,26.6 55.4,26.6 54.15,27.85 28.85,27.85 27.8,26.8 v6.5,26.8
LCD_DATA22  (via drill 0.15)
  Top 0.15: IC1.T10 v62.4,27
  Top 0.2: J2.13 10.47,28.7 v10.94,29.16
  Route2 0.2: v62.4,27 62,27.4 59.7,27.4 59.6,27.4 55.8,27.4 54.7,28.5 28.86,28.5 27.96,29.4 23.5,29.4 23.1,29.8 11.57,29.8 v10.94,29.16
LCD_DATA23  (via drill 0.15)
  Top 0.15: IC1.U10 v61.6,27
  Top 0.2: J2.21 14.47,28.6 v15.03,29.17
  Route2 0.2: v61.6,27 59.7,27 59.6,27 55.5,27 54.33,28.18 28.73,28.18 28.7,28.2 28.65,28.25 27.82,29.07 23.36,29.07 22.97,29.47 15.34,29.47 v15.03,29.17
LCD_HSYNC  (via drill 0.15)
  Top 0.2: IC1.R5 v63.2,31 | v22.5,30.65 21.75,30.65 19.97,28.87 J2.32
  Route15 0.2: v63.2,31 62.8,30.6 22.55,30.6 v22.5,30.65
LCD_PCLK
  Top 0.2: IC1.V5 55.5,30.6 55.05,31.05 20.55,31.05 18.97,29.47 J2.30
LCD_TOUCH_XLEFT  (via drill 0.15)
  Top 0.2: IC1.B6 v74.4,29.4 | v78.1,28.5 80.3,26.3 92.06,26.3 J3.1
  Route2 0.2: v74.4,29.4 77.4,29.4 78.1,28.7 v78.1,28.5
LCD_TOUCH_XRIGHT  (via drill 0.15)
  Top 0.2: IC1.C7 v73.6,29.4 | v79.9,28.1 80.7,27.3 80.8,27.2 80.9,27.1 94.2,27.1 97.11,24.19 J3.3
  Route2 0.2: v73.6,29.4 73.83,29.4 74.23,29 77.03,29 77.93,28.1 v79.9,28.1
LCD_TOUCH_YDOWN
  Top 0.2: IC1.A7 78.1,29 78.2,28.9 78.27,28.9 80.43,26.73 93.37,26.73 96.11,23.99 J3.2
LCD_TOUCH_YUP  (via drill 0.15)
  Top 0.2: IC1.B7 v74.4,28.6 | v81,27.7 95,27.7 98.11,24.59 J3.4
  Route2 0.2: v74.4,28.6 76.97,28.6 77.88,27.7 v81,27.7
LCD_VSYNC  (via drill 0.15)
  Top 0.2: IC1.U5 v61.6,31 | v21.92,30.25 20.47,28.8 J2.33
  Route2 0.2: v61.6,31 55.56,31 55.28,30.73 54,30.73 53.9,30.73 23.14,30.73 22.67,30.25 v21.92,30.25
N$1  (via drill 0.15)
  Top 0.2: v68,32.6 IC1.J3
  Route2 0.15: v68,32.6 69.6,31 v69.6,30.2
  Bottom 0.15: v69.6,30.2 69.6,28.74 R7.2
  Bottom 1: R7.2 R6.2
N$3  (via drill 0.15)
  Top 0.15: U$1.D3 v66.8,40 | v66,40 U$1.B3 | v64.3,43.1 U$1.A7 | U$1.C7 v66,44
  Route2 0.15: v66.8,40 v66,40 64.3,41.7 v64.3,43.1 65.1,43.1 v66,44
  Bottom 0.15: C4.2 64.18,43.1 v64.3,43.1
N$4  (via drill 0.15)
  Top 0.15: U$1.C3 66.2,40.4 65.78,40.83 65.42,40.83 65,40.4 U$1.A3 64.8,42.8 U$1.B7 65.8,43.6 66.22,43.17 66.58,43.17 67,43.6 U$1.D7 v67.6,44
  Bottom 0.15: v67.6,44 68,44.4 68,46.1 68.02,46.12 C5.2
N$6  (via drill 0.15, 0.35)
  Top 0.2: v35.6,47 35.6,47.78 IC5.1 34,48.62 v34,46.5
  Bottom 0.2: v35.6,47 30.4,41.8 | 30.4,41.8 D7.A R18.2 R20.1 | C14.1 30.4,41.25 30.4,41.8
N$7  (via drill 0.35)
  Top 0.3: D9.A 41.38,52.15 v41.38,51.2 IC6.1
  Top 1: IC6.1 43.05,49.1 R22.1
  Bottom 0.152: R21.2 41.38,51.13 v41.38,51.2
  Bottom 0.2: C17.1 41.38,51.67 41.38,51.13
N$9  (via drill 0.15)
  Top 0.3: D2.A 29.57,3.98 31,5.4 36,5.4 38.23,7.63 IC3.1 39.2,9.63 v39.2,11.5
  Bottom 0.152: C3.1 41.19,8.91 42.84,7.26 R2.2
  Bottom 0.2: C3.1 40.51,11.2 R1.1
  Bottom 0.3: v39.2,11.5 40.21,11.5 40.51,11.2
N$10  (via drill 0.35)
  Top 1: D11.A v28.44,51.36 27.38,50.3 IC7.1
  Bottom 0.2: R23.2 27.02,51.36 v28.44,51.36 31.61,51.36 C20.1 33.55,52.3 R24.1
N$40
  Bottom 0.2: R12.1 35.96,15.89 R5.1
N$42  (via drill 0.15)
  Top 0.3: v31.6,6.6 31.2,7 IC2.1 31.2,11.7 v31.1,11.8
  Bottom 0.2: R8.1 32.64,14.67 R12.2 33.85,13.6 37.7,13.6 R11.1
  Bottom 0.3: D1.A 31.6,4.86 v31.6,6.6 | v31.1,11.8 31.93,11.8 R8.1 32.64,10.31 C8.1
N$43
  Bottom 0.2: R9.2 38.1,18.01 38.1,17.7 38.9,16.9 39.6,16.9 39.8,16.7 39.8,16.37 R5.2
N$44
  Bottom 0.2: R9.1 43.21,18.01 R10.1
N$45
  Bottom 0.2: R10.2 40.71,20.19 R13.2
N$46  (via drill 0.35)
  Top 0.2: v21.5,10.7 22.12,10.7 24.12,8.7 IC4.1 22.55,7.03 R15.1 22.57,5.37 D5.A
  Bottom 0.2: R19.2 22.82,11.78 | 22.82,11.78 21.75,10.7 v21.5,10.7 | C11.1 22.82,14.17 22.82,11.78
N$47
  Bottom 0.2: R19.1 25.91,10.85 25.91,8.75 24.85,7.7 R14.1
N$48
  Bottom 0.2: R16.2 R14.2
N$49
  Bottom 0.2: R16.1 24.85,9.05 23.8,8 23.8,6.25 R17.2
NRESET_IN_OUT_AM3358
  Top 0.2: J4.10 79.76,23.34 76.5,26.6 IC1.A10
SD_CLK  (via drill 0.15)
  Top 0.15: IC1.G17 v69.6,20.6
  Top 0.2: v69.6,14.3 69.6,12.71 J1.5
  Route2 0.2: v69.6,20.6 69.6,18.6 v69.6,14.3
SD_CMD
  Top 0.15: IC1.G18 70,18.6
  Top 0.2: 70,18.6 65,13.6 64.5,13.6 64.3,13.4 64.3,12.1 64.7,11.7 66.6,11.7 67.36,12.46 J1.3
SD_D0  (via drill 0.15)
  Top 0.15: IC1.G16 v69.6,21.4
  Top 0.2: v70,14.8 71.77,13.04 J1.7
  Route2 0.2: v69.6,21.4 70,21 v70,14.8
SD_D1  (via drill 0.15)
  Top 0.15: IC1.G15 v70.4,22.2
  Top 0.2: v70.8,15.8 72.81,13.79 J1.8
  Route2 0.2: v70.4,22.2 70.4,21.4 70.8,21 v70.8,15.8
SD_D2
  Top 0.15: IC1.F18 70.8,18.6
  Top 0.2: J1.1 65.17,12.96 70.8,18.6
SD_D3  (via drill 0.15)
  Top 0.15: IC1.F17 v70.4,20.6
  Top 0.2: J1.2 66.27,13.16 68.4,15.3 v70.4,15.3
  Route2 0.2: v70.4,20.6 v70.4,15.3
VIN  (via drill 0.15, 0.35, 0.5)  (3 unrouted)
  Top 0.152: IC4.3 27.9,8.6 v27,9.5
  Top 0.3: v30,18.8 29.9,18.7 29.9,16.4
  Top 1: v15.6,36.6 17.77,36.6 PS1.2 19.18,36.98
  Bottom 0.152: v27,9.5 27,8.11 C6.1
  Bottom 0.2: D6.C 28.8,17.5 30,18.7 v30,18.8 | D8.C 41.12,45.7 C1.1 41.12,43.77 D10.C 42.8,41.8 v43.1,41.5 | 22.5,53.1 24.45,53.1 C18.1
  Bottom 0.3: D4.C 31.08,17.72 v30,18.8
  Bottom 0.5: D10.C 36.73,37.4 36,37.4 34,35.4 34,35.3 31.3,35.3 30.2,36.4 C15.1
  Bottom 1: v15.6,36.6 1.79,36.6 1.8,21.6 20.49,21.6 20.5,21.61 20.98,21.61 22.2,20.4 22.2,19.4 v21.7,18.9 | C15.1 C12.1 C9.1 20.91,36.85 20.78,36.98
  Bottom 2: PS1.2 20.78,36.98 22.5,38.7 22.5,53.1 v22.4,53.1
  pour Top: 20,40.1 20,38.2 43.2,38.2 arc90 47.3,42.3 47.3,55 20,55
  pour Top: 20,19.3 43.5,19.3 arc-90 47.3,15.5 47.3,0 20,0
VIN_3.3  (via drill 0.15, 0.35)
  Top 0.15: 50.8,47 50.3,47 | v32.6,47.6 32.6,44.6 32.09,44.09 32.09,41.81
  Top 0.2: IC7.4 25.05,41.77 v25.05,45.8 | D9.C 36.48,52.08 v35.6,51.2
  Top 0.5: v35.6,39.4 34.52,39.4 IC5.4
  Top 1: D11.C D9.C | 38.5,41.8 41.92,45.23 D12.A 45.95,46.08 R22.2 49.6,48.3 49.7,48.4
  Top 3: IC6.4 39.1,35.6 39,35.5
  Top 6: IC7.4 25.11,41.71 32.09,41.81 IC5.4 35.8,41.81 38.5,41.8
  Bottom 0.15: C16.1 31.35,47.3 | 31.35,47.3 31.35,46.1 C13.1 | 31.35,47.3 32.3,47.3 v32.6,47.6
  Bottom 0.152: D8.A 37.08,41.9 D10.A
  Bottom 0.2: D10.A D7.C | D8.A 37.08,48.68 35.73,50.03 | 35.73,50.03 R24.2 | C19.1 25.05,47.3 v25.05,45.8 R20.2 | v35.6,51.2 35.73,51.07 35.73,50.03
  Bottom 0.5: 36.69,41.41 35.6,40.33 v35.6,39.4
  Bottom 1: D7.C 34.23,41.9 37.08,41.9 | 36.69,41.41 D10.A
  pour Top: 0,33 0,20 45.7,20 48.4,17.3 48.4,0 106.5,0 106.5,56 48.5,56 48.5,40.6 45.2,37.3 12.2,37.3
VIN_5  (via drill 0.15)
  Top 0.3: D2.C 36.56,2.87 D3.A 37.46,3.06 41.2,6.8 41.2,10.4 42.3,11.5 42.4,11.5 v42.4,11.6
  Top 0.5: IC3.4 40.51,13.49 v42.4,11.6
  Bottom 0.3: v42.4,11.6 40.56,13.44 R1.2
  Bottom 0.5: R1.2 40.51,14.11 42.21,15.81 C2.1
VIN_9.6  (via drill 0.15)
  Top 0.2: 4.97,26.5 J2.2
  Top 0.3: IC2.4 36.1,13.18 v36.1,11.9
  Top 1: 4.97,26.5 4.97,23.33 6.6,21.7 21,21.7 22.6,20.1 v30.7,20.1 33.48,17.32 IC2.4
  Bottom 0.3: v36.1,11.9 35.35,11.9 R8.2 36.1,11.15 36.1,7.1 35.6,6.6 33.7,6.6 32.88,7.42 C7.1 32.74,7.9 31.7,7.9 29.59,5.79 D1.C
  Bottom 0.5: R11.2 36.49,11.51 v36.1,11.9
  Bottom 1: D4.A 35.52,19.59 35,20.1 v30.7,20.1
VIN_12  (via drill 0.15, 0.35)
  Top 0.2: v22.9,17.7 24.48,17.7 IC4.4 v26.4,5.4 | v26.4,5.4 26.4,3.02 D5.C | R15.2 v26.4,5.4
  Bottom 0.2: v22.9,17.7 24.18,17.7 D6.A | C10.1 26.4,4.55 v26.4,5.4

### Text on the board
tPlace: power | + | -
bPlace: + | -
tValues: SD Card | Made by Samarth / fenrir-so.tech / Ref -> aq003_cortexA8/testBoard / / PROTOTYE 001